# EAGLE design V2.2 (EAGLE 8.5.1)

## Sheet 1 of 8: ATMEGA32
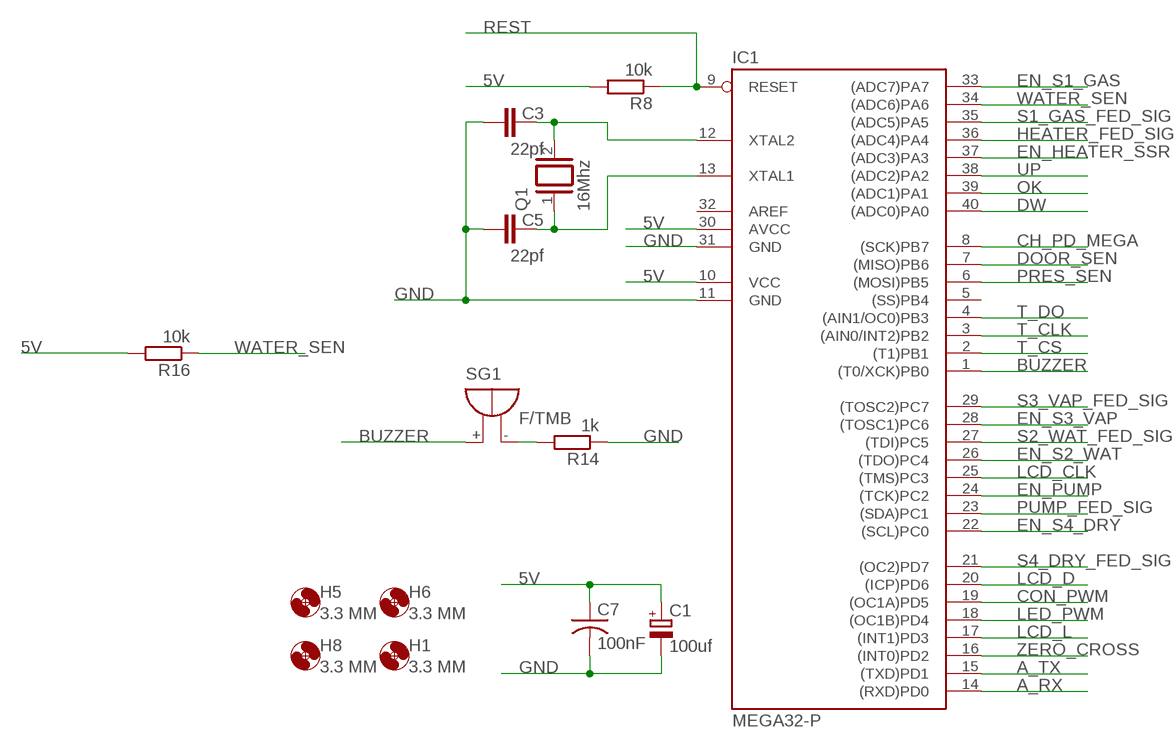
[diagram p0: schematic, sheet 1]

### Parts
C1  100uf  CPOL-EUE3.5-8  [E3,5-8]
C3  22pf  C-EU050-030X075  [C050-030X075]
C5  22pf  C-EU050-030X075  [C050-030X075]
C7  100nF  C-US050-035X075  [C050-035X075]
H1  3.3 MM  MOUNT-HOLE3.3  [3,3]
H5  3.3 MM  MOUNT-HOLE3.3  [3,3]
H6  3.3 MM  MOUNT-HOLE3.3  [3,3]
H8  3.3 MM  MOUNT-HOLE3.3  [3,3]
IC1  MEGA32-P  [DIL40]
Q1  16Mhz  XTAL/S  [QS]
R8  10k  R-EU_0207/10  [0207/10]
R14  1k  R-EU_0207/10  [0207/10]
R16  10k  R-EU_0207/10  [0207/10]
SG1  F/TMB  [F/TMB]

### Nets
5V: C1.+ C7.1 IC1.10(VCC) IC1.30(AVCC) R8.2 R16.2 ; also sheet 2,7,8
A_RX: IC1.14((RXD)PD0) ; also sheet 4
A_TX: IC1.15((TXD)PD1) ; also sheet 4
BUZZER: IC1.1((T0/XCK)PB0) SG1.+
CH_PD_MEGA: IC1.8((SCK)PB7) ; also sheet 4
CON_PWM: IC1.19((OC1A)PD5) ; also sheet 3
DOOR_SEN: IC1.7((MISO)PB6) ; also sheet 6
DW: IC1.40((ADC0)PA0) ; also sheet 6
EN_HEATER_SSR: IC1.37((ADC3)PA3) ; also sheet 6
EN_PUMP: IC1.24((TCK)PC2) ; also sheet 2
EN_S1_GAS: IC1.33((ADC7)PA7) ; also sheet 2
EN_S2_WAT: IC1.26((TDO)PC4) ; also sheet 2
EN_S3_VAP: IC1.28((TOSC1)PC6) ; also sheet 2
EN_S4_DRY: IC1.22((SCL)PC0) ; also sheet 2
GND: C1.- C3.1 C5.1 C7.2 IC1.11(GND) IC1.31(GND) R14.1 ; also sheet 2,3,4,5,6,7,8
HEATER_FED_SIG: IC1.36((ADC4)PA4)
LCD_CLK: IC1.25((TMS)PC3) ; also sheet 3
LCD_D: IC1.20((ICP)PD6) ; also sheet 3
LCD_L: IC1.17((INT1)PD3) ; also sheet 3
LED_PWM: IC1.18((OC1B)PD4) ; also sheet 3
N$7: C5.2 IC1.13(XTAL1) Q1.1
N$16: C3.2 IC1.12(XTAL2) Q1.2
N$62: R14.2 SG1.-
OK: IC1.39((ADC1)PA1) ; also sheet 6
PRES_SEN: IC1.6((MOSI)PB5) ; also sheet 6
PUMP_FED_SIG: IC1.23((SDA)PC1) ; also sheet 2
REST: IC1.9(RESET) R8.1 ; also sheet 4
S1_GAS_FED_SIG: IC1.35((ADC5)PA5) ; also sheet 2
S2_WAT_FED_SIG: IC1.27((TDI)PC5) ; also sheet 2
S3_VAP_FED_SIG: IC1.29((TOSC2)PC7) ; also sheet 2
S4_DRY_FED_SIG: IC1.21((OC2)PD7) ; also sheet 2
T_CLK: IC1.3((AIN0/INT2)PB2) ; also sheet 8
T_CS: IC1.2((T1)PB1) ; also sheet 8
T_DO: IC1.4((AIN1/OC0)PB3) ; also sheet 8
UP: IC1.38((ADC2)PA2) ; also sheet 6
WATER_SEN: IC1.34((ADC6)PA6) R16.1 ; also sheet 6
ZERO_CROSS: IC1.16((INT0)PD2) ; also sheet 5
Unconnected: IC1.5((SS)PB4) IC1.32(AREF)

## Sheet 2 of 8: Current Detect
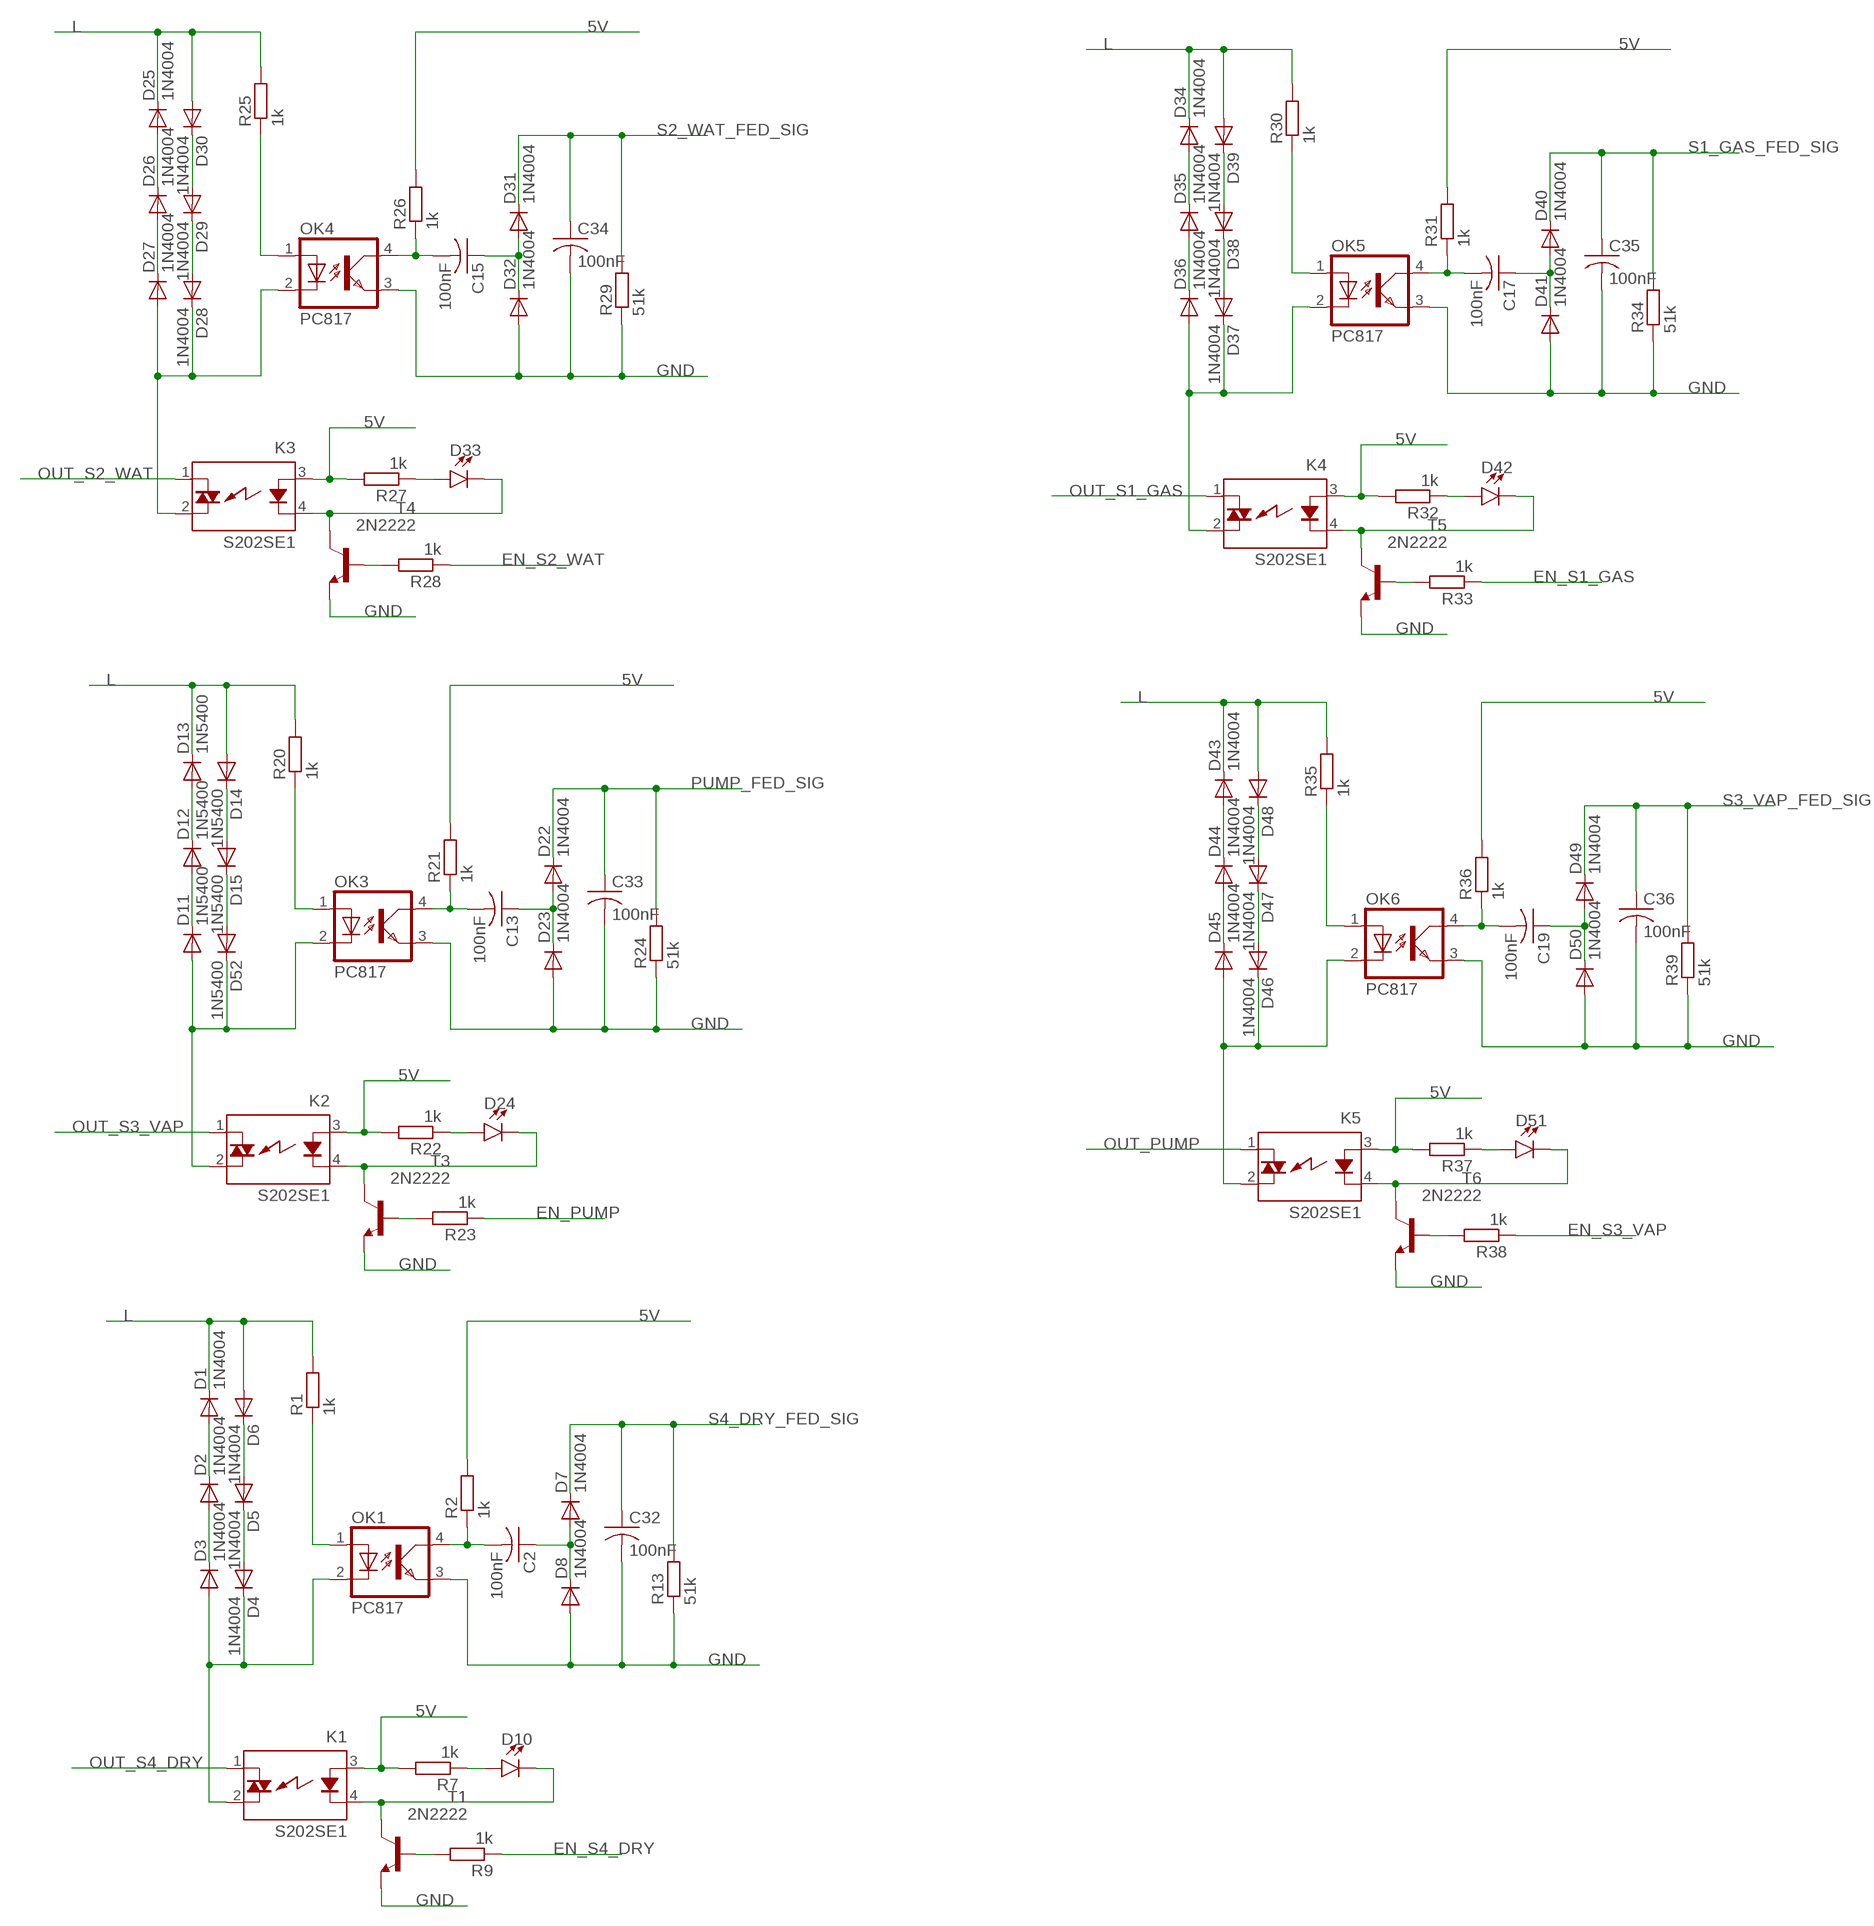
[diagram p1: schematic, sheet 2]

### Parts
C2  100nF  C-US050-035X075  [C050-035X075]
C13  100nF  C-US050-035X075  [C050-035X075]
C15  100nF  C-US050-035X075  [C050-035X075]
C17  100nF  C-US050-035X075  [C050-035X075]
C19  100nF  C-US050-035X075  [C050-035X075]
C32  100nF  C-US050-035X075  [C050-035X075]
C33  100nF  C-US050-035X075  [C050-035X075]
C34  100nF  C-US050-035X075  [C050-035X075]
C35  100nF  C-US050-035X075  [C050-035X075]
C36  100nF  C-US050-035X075  [C050-035X075]
D1  1N4004  [DO41-10]
D2  1N4004  [DO41-10]
D3  1N4004  [DO41-10]
D4  1N4004  [DO41-10]
D5  1N4004  [DO41-10]
D6  1N4004  [DO41-10]
D7  1N4004  [DO41-10]
D8  1N4004  [DO41-10]
D10  LED5MM  [LED_5MM]
D11  1N5400  [DO201-15]
D12  1N5400  [DO201-15]
D13  1N5400  [DO201-15]
D14  1N5400  [DO201-15]
D15  1N5400  [DO201-15]
D22  1N4004  [DO41-10]
D23  1N4004  [DO41-10]
D24  LED5MM  [LED_5MM]
D25  1N4004  [DO41-10]
D26  1N4004  [DO41-10]
D27  1N4004  [DO41-10]
D28  1N4004  [DO41-10]
D29  1N4004  [DO41-10]
D30  1N4004  [DO41-10]
D31  1N4004  [DO41-10]
D32  1N4004  [DO41-10]
D33  LED5MM  [LED_5MM]
D34  1N4004  [DO41-10]
D35  1N4004  [DO41-10]
D36  1N4004  [DO41-10]
D37  1N4004  [DO41-10]
D38  1N4004  [DO41-10]
D39  1N4004  [DO41-10]
D40  1N4004  [DO41-10]
D41  1N4004  [DO41-10]
D42  LED5MM  [LED_5MM]
D43  1N4004  [DO41-10]
D44  1N4004  [DO41-10]
D45  1N4004  [DO41-10]
D46  1N4004  [DO41-10]
D47  1N4004  [DO41-10]
D48  1N4004  [DO41-10]
D49  1N4004  [DO41-10]
D50  1N4004  [DO41-10]
D51  LED5MM  [LED_5MM]
D52  1N5400  [DO201-15]
K1  S202SE1  [S2XXEX]
K2  S202SE1  [S2XXEX]
K3  S202SE1  [S2XXEX]
K4  S202SE1  [S2XXEX]
K5  S202SE1  [S2XXEX]
OK1  PC817  [DIL04]
OK3  PC817  [DIL04]
OK4  PC817  [DIL04]
OK5  PC817  [DIL04]
OK6  PC817  [DIL04]
R1  1k  R-EU_0207/10  [0207/10]
R2  1k  R-EU_0207/10  [0207/10]
R7  1k  R-EU_0207/10  [0207/10]
R9  1k  R-EU_0207/10  [0207/10]
R13  51k  R-EU_0207/10  [0207/10]
R20  1k  R-EU_0207/10  [0207/10]
R21  1k  R-EU_0207/10  [0207/10]
R22  1k  R-EU_0207/10  [0207/10]
R23  1k  R-EU_0207/10  [0207/10]
R24  51k  R-EU_0207/10  [0207/10]
R25  1k  R-EU_0207/10  [0207/10]
R26  1k  R-EU_0207/10  [0207/10]
R27  1k  R-EU_0207/10  [0207/10]
R28  1k  R-EU_0207/10  [0207/10]
R29  51k  R-EU_0207/10  [0207/10]
R30  1k  R-EU_0207/10  [0207/10]
R31  1k  R-EU_0207/10  [0207/10]
R32  1k  R-EU_0207/10  [0207/10]
R33  1k  R-EU_0207/10  [0207/10]
R34  51k  R-EU_0207/10  [0207/10]
R35  1k  R-EU_0207/10  [0207/10]
R36  1k  R-EU_0207/10  [0207/10]
R37  1k  R-EU_0207/10  [0207/10]
R38  1k  R-EU_0207/10  [0207/10]
R39  51k  R-EU_0207/10  [0207/10]
T1  2N2222  [TO92-EBC-OVAL]
T3  2N2222  [TO92-EBC-OVAL]
T4  2N2222  [TO92-EBC-OVAL]
T5  2N2222  [TO92-EBC-OVAL]
T6  2N2222  [TO92-EBC-OVAL]

### Nets
5V: K1.3(A) K2.3(A) K3.3(A) K4.3(A) K5.3(A) R2.2 R7.2 R21.2 R22.2 R26.2 R27.2 R31.2 R32.2 R36.2 R37.2 ; also sheet 1,7,8
EN_PUMP: R23.1 ; also sheet 1
EN_S1_GAS: R33.1 ; also sheet 1
EN_S2_WAT: R28.1 ; also sheet 1
EN_S3_VAP: R38.1 ; also sheet 1
EN_S4_DRY: R9.1 ; also sheet 1
GND: C32.2 C33.2 C34.2 C35.2 C36.2 D8.A D23.A D32.A D41.A D50.A OK1.3(EMIT) OK3.3(EMIT) OK4.3(EMIT) OK5.3(EMIT) OK6.3(EMIT) R13.1 R24.1 R29.1 R34.1 R39.1 T1.E T3.E T4.E T5.E T6.E ; also sheet 1,3,4,5,6,7,8
L: D1.C D6.A D13.C D14.A D25.C D30.A D34.C D39.A D43.C D48.A R1.2 R20.2 R25.2 R30.2 R35.2 ; also sheet 6
N$1: D2.A D3.C
N$2: D1.A D2.C
N$3: C2.2 OK1.4(COL) R2.1
N$4: C2.1 D7.A D8.C
N$5: D5.A D6.C
N$6: D4.A D5.C
N$8: D10.K(C) K1.4(K) T1.C
N$9: OK1.1(A) R1.1
N$10: D11.C D12.A
N$11: D10.A R7.1
N$13: R9.2 T1.B
N$14: D3.A D4.C K1.2(DS2) OK1.2(C)
N$15: D12.C D13.A
N$17: D14.C D15.A
N$18: D15.C D52.A
N$19: OK3.1(A) R20.1
N$20: C13.2 OK3.4(COL) R21.1
N$21: C13.1 D22.A D23.C
N$23: D24.A R22.1
N$24: D24.K(C) K2.4(K) T3.C
N$25: R23.2 T3.B
N$26: D26.A D27.C
N$27: D25.A D26.C
N$28: D29.A D30.C
N$29: D28.A D29.C
N$30: OK4.1(A) R25.1
N$31: C15.2 OK4.4(COL) R26.1
N$32: C15.1 D31.A D32.C
N$33: D27.A D28.C K3.2(DS2) OK4.2(C)
N$34: D33.A R27.1
N$35: D33.K(C) K3.4(K) T4.C
N$36: R28.2 T4.B
N$37: D35.A D36.C
N$38: D34.A D35.C
N$39: D38.A D39.C
N$40: D37.A D38.C
N$41: OK5.1(A) R30.1
N$42: C17.2 OK5.4(COL) R31.1
N$43: C17.1 D40.A D41.C
N$44: D36.A D37.C K4.2(DS2) OK5.2(C)
N$45: D42.A R32.1
N$46: D42.K(C) K4.4(K) T5.C
N$51: D11.A D52.C K2.2(DS2) OK3.2(C)
N$52: R33.2 T5.B
N$53: D44.A D45.C
N$56: D43.A D44.C
N$57: D47.A D48.C
N$58: D46.A D47.C
N$59: OK6.1(A) R35.1
N$60: C19.2 OK6.4(COL) R36.1
N$61: C19.1 D49.A D50.C
N$63: D45.A D46.C K5.2(DS2) OK6.2(C)
N$64: D51.A R37.1
N$65: D51.K(C) K5.4(K) T6.C
N$66: R38.2 T6.B
OUT_PUMP: K5.1(DS1) ; also sheet 6
OUT_S1_GAS: K4.1(DS1) ; also sheet 6
OUT_S2_WAT: K3.1(DS1) ; also sheet 6
OUT_S3_VAP: K2.1(DS1) ; also sheet 6
OUT_S4_DRY: K1.1(DS1) ; also sheet 6
PUMP_FED_SIG: C33.1 D22.C R24.2 ; also sheet 1
S1_GAS_FED_SIG: C35.1 D40.C R34.2 ; also sheet 1
S2_WAT_FED_SIG: C34.1 D31.C R29.2 ; also sheet 1
S3_VAP_FED_SIG: C36.1 D49.C R39.2 ; also sheet 1
S4_DRY_FED_SIG: C32.1 D7.C R13.2 ; also sheet 1

## Sheet 3 of 8: LCD_Shift
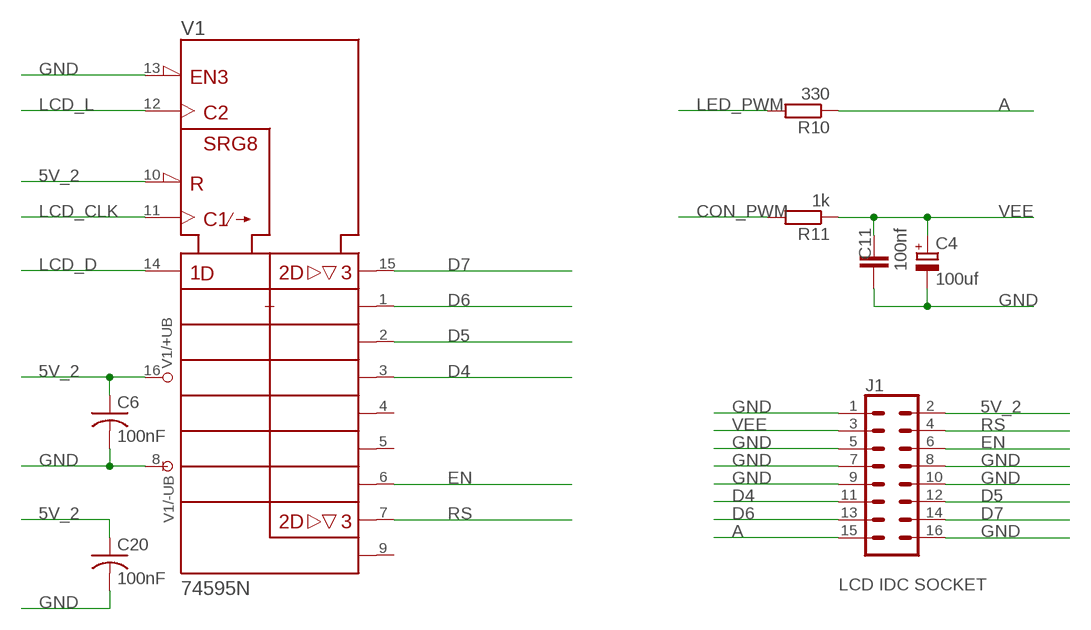
[diagram p2: schematic, sheet 3]

### Parts
C4  100uf  CPOL-EUE3.5-8  [E3,5-8]
C6  100nF  C-US050-035X075  [C050-035X075]
C11  100nf  C-EU050-030X075  [C050-030X075]
C20  100nF  C-US050-035X075  [C050-035X075]
J1  CONN_08X2  [2X8]
R10  330  R-EU_0207/10  [0207/10]
R11  1k  R-EU_0207/10  [0207/10]
V1  74595N  [DIL16]

### Nets
5V_2: C6.1 C20.1 J1.2 V1.10(!SRCLR) V1.16(+UB) ; also sheet 5,7
A: J1.15 R10.1
CON_PWM: R11.2 ; also sheet 1
D4: J1.11 V1.3(QD)
D5: J1.12 V1.2(QC)
D6: J1.13 V1.1(QB)
D7: J1.14 V1.15(QA)
EN: J1.6 V1.6(QG)
GND: C4.- C6.2 C11.1 C20.2 J1.1 J1.5 J1.7 J1.8 J1.9 J1.10 J1.16 V1.8(-UB) V1.13(!G) ; also sheet 1,2,4,5,6,7,8
LCD_CLK: V1.11(SRCK) ; also sheet 1
LCD_D: V1.14(SER) ; also sheet 1
LCD_L: V1.12(RCK) ; also sheet 1
LED_PWM: R10.2 ; also sheet 1
RS: J1.4 V1.7(QH)
VEE: C4.+ C11.2 J1.3 R11.1
Unconnected: V1.4(QE) V1.5(QF) V1.9(QH*)

### Notes on the sheet
- LCD IDC SOCKET

## Sheet 4 of 8: ESP LINK
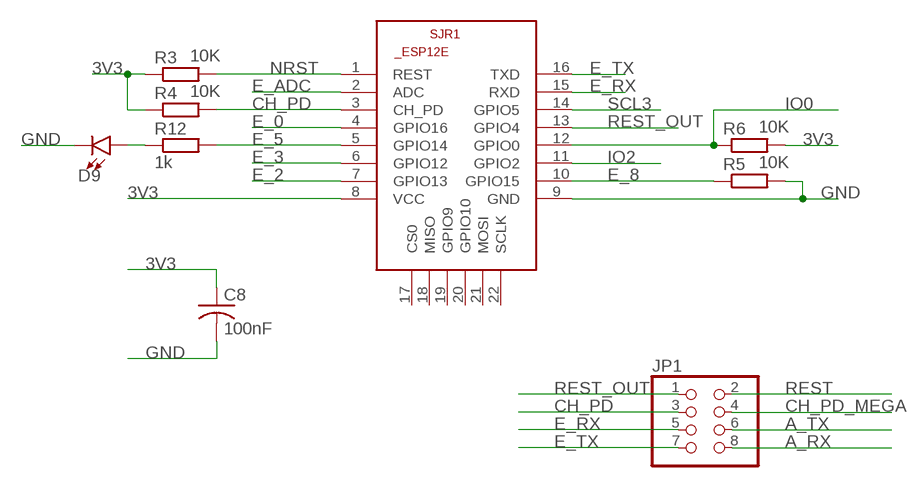
[diagram p3: schematic, sheet 4]

### Parts
C8  100nF  C-US050-035X075  [C050-035X075]
D9  LED5MM  [LED_5MM]
JP1  PINHD-2X4  [2X04]
R3  10K  R-EU_0207/10  [0207/10]
R4  10K  R-EU_0207/10  [0207/10]
R5  10K  R-EU_0207/10  [0207/10]
R6  10K  R-EU_0207/10  [0207/10]
R12  1k  R-EU_0207/10  [0207/10]
SJR1  ESP8266-12EESP12E  [ESP8266-ESP12E]

### Nets
3V3: C8.1 R3.1 R4.1 R6.2 SJR1.8(VCC) ; also sheet 7
A_RX: JP1.8 ; also sheet 1
A_TX: JP1.6 ; also sheet 1
CH_PD: JP1.3 R4.2 SJR1.3(CH_PD)
CH_PD_MEGA: JP1.4 ; also sheet 1
E_0: SJR1.4(GPIO16)
E_2: SJR1.7(GPIO13)
E_3: SJR1.6(GPIO12)
E_5: R12.2 SJR1.5(GPIO14)
E_8: R5.1 SJR1.10(GPIO15)
E_ADC: SJR1.2(ADC)
E_RX: JP1.5 SJR1.15(RXD)
E_TX: JP1.7 SJR1.16(TXD)
GND: C8.2 D9.K(C) R5.2 SJR1.9(GND) ; also sheet 1,2,3,5,6,7,8
IO0: R6.1 SJR1.12(GPIO0)
IO2: SJR1.11(GPIO2)
N$12: D9.A R12.1
NRST: R3.2 SJR1.1(REST)
REST: JP1.2 ; also sheet 1
REST_OUT: JP1.1 SJR1.13(GPIO4)
SCL3: SJR1.14(GPIO5)
Unconnected: SJR1.17(CS0) SJR1.18(MISO) SJR1.19(GPIO9) SJR1.20(GPIO10) SJR1.21(MOSI) SJR1.22(SCLK)

## Sheet 5 of 8: Zero_Cross Detect
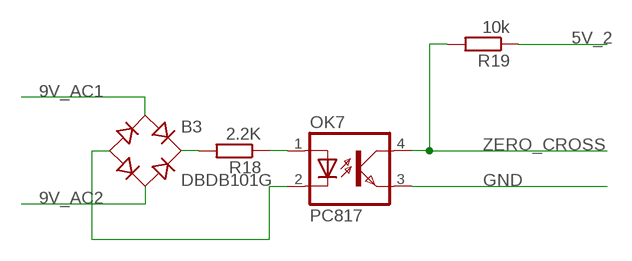
[diagram p4: schematic, sheet 5]

### Parts
B3  DBDB101G  [DB]
OK7  PC817  [DIL04]
R18  2.2K  R-EU_0207/10  [0207/10]
R19  10k  R-EU_0207/10  [0207/10]

### Nets
5V_2: R19.1 ; also sheet 3,7
9V_AC1: B3.AC1 ; also sheet 6,7
9V_AC2: B3.AC2 ; also sheet 6,7
GND: OK7.3(EMIT) ; also sheet 1,2,3,4,6,7,8
N$47: B3.+ R18.2
N$48: OK7.1(A) R18.1
N$49: B3.- OK7.2(C)
ZERO_CROSS: OK7.4(COL) R19.2 ; also sheet 1

## Sheet 6 of 8: Terminals
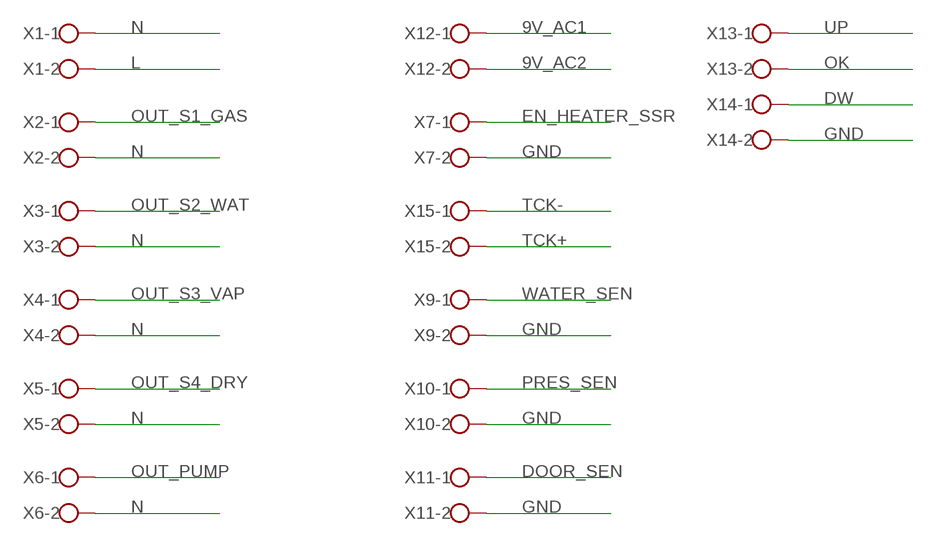
[diagram p5: schematic, sheet 6]

### Parts
X1  W237-102  [W237-102]
X2  W237-102  [W237-102]
X3  W237-102  [W237-102]
X4  W237-102  [W237-102]
X5  W237-102  [W237-102]
X6  W237-102  [W237-102]
X7  W237-102  [W237-102]
X9  W237-102  [W237-102]
X10  W237-102  [W237-102]
X11  W237-102  [W237-102]
X12  W237-102  [W237-102]
X13  W237-102  [W237-102]
X14  W237-102  [W237-102]
X15  W237-102  [W237-102]

### Nets
9V_AC1: X12.1 ; also sheet 5,7
9V_AC2: X12.2 ; also sheet 5,7
DOOR_SEN: X11.1 ; also sheet 1
DW: X14.1 ; also sheet 1
EN_HEATER_SSR: X7.1 ; also sheet 1
GND: X7.2 X9.2 X10.2 X11.2 X14.2 ; also sheet 1,2,3,4,5,7,8
L: X1.2 ; also sheet 2
N: X1.1 X2.2 X3.2 X4.2 X5.2 X6.2
OK: X13.2 ; also sheet 1
OUT_PUMP: X6.1 ; also sheet 2
OUT_S1_GAS: X2.1 ; also sheet 2
OUT_S2_WAT: X3.1 ; also sheet 2
OUT_S3_VAP: X4.1 ; also sheet 2
OUT_S4_DRY: X5.1 ; also sheet 2
PRES_SEN: X10.1 ; also sheet 1
TCK+: X15.2 ; also sheet 8
TCK-: X15.1 ; also sheet 8
UP: X13.1 ; also sheet 1
WATER_SEN: X9.1 ; also sheet 1

## Sheet 7 of 8: POWER
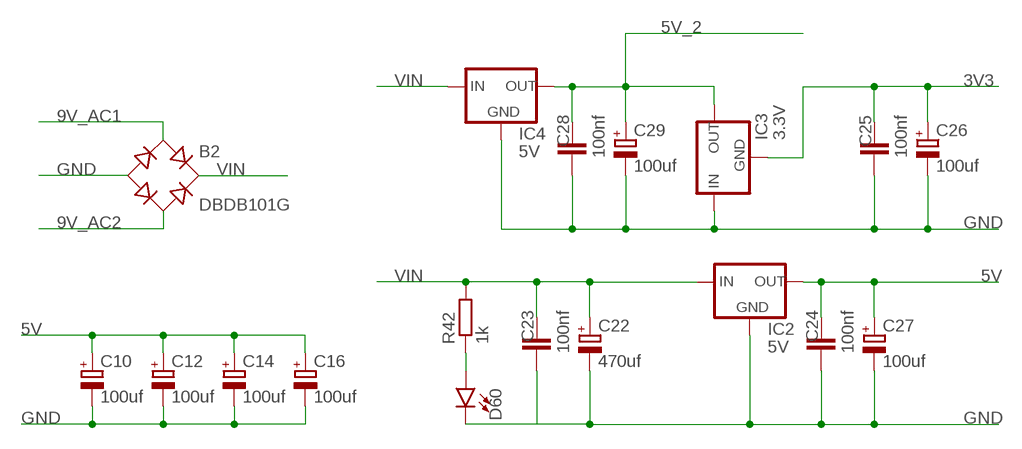
[diagram p6: schematic, sheet 7]

### Parts
B2  DBDB101G  [DB]
C10  100uf  CPOL-EUE3.5-8  [E3,5-8]
C12  100uf  CPOL-EUE3.5-8  [E3,5-8]
C14  100uf  CPOL-EUE3.5-8  [E3,5-8]
C16  100uf  CPOL-EUE3.5-8  [E3,5-8]
C22  470uf  CPOL-EUE3.5-8  [E3,5-8]
C23  100nf  C-EU050-030X075  [C050-030X075]
C24  100nf  C-EU050-030X075  [C050-030X075]
C25  100nf  C-EU050-030X075  [C050-030X075]
C26  100uf  CPOL-EUE3.5-8  [E3,5-8]
C27  100uf  CPOL-EUE3.5-8  [E3,5-8]
C28  100nf  C-EU050-030X075  [C050-030X075]
C29  100uf  CPOL-EUE3.5-8  [E3,5-8]
D60  LED5MM  [LED_5MM]
IC2  5V  V_REG_78XXSIDE  [78XXL]
IC3  3.3V  V_REG_78XXSIDE  [78XXL]
IC4  5V  V_REG_78XXSIDE  [78XXL]
R42  1k  R-EU_0207/10  [0207/10]

### Nets
3V3: C25.2 C26.+ IC3.GND ; also sheet 4
5V: C10.+ C12.+ C14.+ C16.+ C24.2 C27.+ IC2.OUT ; also sheet 1,2,8
5V_2: C28.2 C29.+ IC3.OUT IC4.OUT ; also sheet 3,5
9V_AC1: B2.AC1 ; also sheet 5,6
9V_AC2: B2.AC2 ; also sheet 5,6
GND: B2.- C10.- C12.- C14.- C16.- C22.- C23.1 C24.1 C25.1 C26.- C27.- C28.1 C29.- D60.K(C) IC2.GND IC3.IN IC4.GND ; also sheet 1,2,3,4,5,6,8
N$74: D60.A R42.1
VIN: B2.+ C22.+ C23.2 IC2.IN IC4.IN R42.2

## Sheet 8 of 8: Thermocoupler
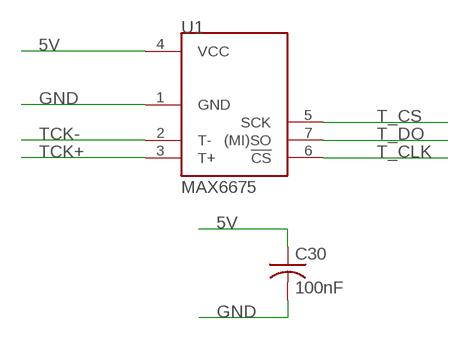
[diagram p7: schematic, sheet 8]

### Parts
C30  100nF  C-US050-035X075  [C050-035X075]
U1  MAX6675  [SOIC8]

### Nets
5V: C30.1 U1.4(VCC) ; also sheet 1,2,7
GND: C30.2 U1.1(GND) ; also sheet 1,2,3,4,5,6,7
T_CLK: U1.6(!CS) ; also sheet 1
T_CS: U1.5(SCK) ; also sheet 1
T_DO: U1.7((MI)SO) ; also sheet 1
TCK+: U1.3(T+) ; also sheet 6
TCK-: U1.2(T-) ; also sheet 6

## Library data of the parts
B2 B3 = rectifier:DB?*G: Single Phase 1.0 AMP Glass Passivated Bridge Rectifier Taiwan Semiconductor Co.,Ltd. - TSC Source: http://www.taiwansemi.com/TSCbig5/ezcatfiles/cust/img/img/db101g.pdf http://www.ts.com.tw/db/pictures/modules/PDT/PDT060207001/DBLS201G.pdf
C1 C4 C10 C12 C14 C16 C22 C26 C27 C29 = rcl:CPOL-EU: POLARIZED CAPACITOR, European symbol
C2 C6-C8 C13 C15 C17 C19 C20 C30 C32-C36 = rcl:C-US: CAPACITOR, American symbol; SPICEPREFIX: C
C3 C5 C11 C23-C25 C28 = rcl:C-EU: CAPACITOR, European symbol
D1-D8 D22 D23 D25-D32 D34-D41 D43-D50 = adafruit:1N4004: DIODE General purpose 1N400x type rectifier (With bigger pads) http://www.ladyada.net/library/pcb/eaglelibrary.html
D9 D10 D24 D33 D42 D51 D60 = SparkFun-LED:LED: LED (Generic) Standard schematic elements and footprints for 5mm, 3mm, 1206, and 0603 sized LEDs. Generic LEDs with no color specified.
D11-D15 D52 = diode:1N5400: DIODE standard rectifier, 3 A, 50 V (Motorola)
H1 H5 H6 H8 = holes:MOUNT-HOLE: MOUNTING HOLE with drill center marker
IC1 = atmel:MEGA32-P: MICROCONTROLLER 32 Kbytes FLASH 2 Kbytes SRAM 1 Kbytes EEPROM USART 8-channel 10 bit ADC Source: www.atmel.com .. doc2503.pdf; MPN: ATMEGA32-16PU; OC_FARNELL: 1661729; OC_NEWARK: 51P1794
IC2-IC4 = SparkFun:V_REG_78XX: Voltage Regulator Standard 7805 5V regulator. IGO (Input Ground Output). Spark Fun Electronics SKU : COM-00107
J1 = SparkFun-Connectors:CONN_08X2: Multi connection point. Often used as Generic Header-pin footprint for 0.1 inch spaced/style header connections You can populate with any combo of single row headers, but if you'd like an exact match, check this: Header - 2x8 (Male, 0.1") <https://www.sparkfun.com/products/13156> (PRT-13156) On any of the 0.1 inch spaced packages, you can populate with these: Break Away Headers - Straight <https://www.sparkfun.com/products/116> (PRT-00116) Break Away Male Headers - Right Angle <https://www.sparkfun.com/products/553> (PRT-00553) Female Headers <https://www.sparkfun.com/products/115> (PRT-00115) Break Away Headers - Machine Pin <https://www.sparkfun.com/products/117> (PRT-00117) Break Away Female Headers - Swiss Machine Pin <https://www.sparkfun.com/products/743> (PRT-00743)
JP1 = pinhead:PINHD-2X4: PIN HEADER
K1-K5 = relay:S2*: SIP Type SSR for Medium Power Control SHARP Source: 168149-da-01-en-Solid_State_Relais_S_202_SE1_SE2.pdf; OC_FARNELL: unknown; OC_NEWARK: unknown
OK1 OK3-OK7 = optocoupler-2:PC817: SHARP OPTO COUPLER
Q1 = special:XTAL/S: CRYSTAL
R1 R2 R7-R14 R16 R18-R39 R42 = rcl:R-EU_: RESISTOR, European symbol
R3-R6 = rcl:R-EU_: RESISTOR, European symbol; SPICEPREFIX: R
SG1 = buzzer:F/TMB: BUZZER Source: Buerklin; OC_FARNELL: unknown; OC_NEWARK: unknown
SJR1 = esp12e:ESP8266-12E: ESP8266-12E Library for Eagle CAD The author not responsible for any damages or errors!. Created by Suhail jr.lt;/author>
T1 T3-T6 = adafruit:2N2222: NPN TRANSISTOR Big oval pads
U1 = SparkFun-Retired:MAX6675: Cold-Junction-Compensated K-Thermocoupleto-Digital Converter (0°C to +1024°C) The MAX6675 performs cold-junction compensation and digitizes the signal from a type-K thermocouple. The data is output in a 12-bit resolution, SPI™-compatible, read-only format. This converter resolves temperatures to 0.25°C, allows readings as high as +1024°C, and exhibits thermocouple accuracy of 8LSBs for temperatures ranging from 0°C to +700°C. Dead Prototype: IC-12512; PROD_ID: IC-12512
V1 = 74ttl-din:74*595: 8-bit SHIFT REGISTER, output latch
X1-X7 X9-X15 = con-wago-500:W237-102: WAGO SCREW CLAMP; MPN: 237-102; OC_FARNELL: unknown; OC_NEWARK: 70K9898

## Board
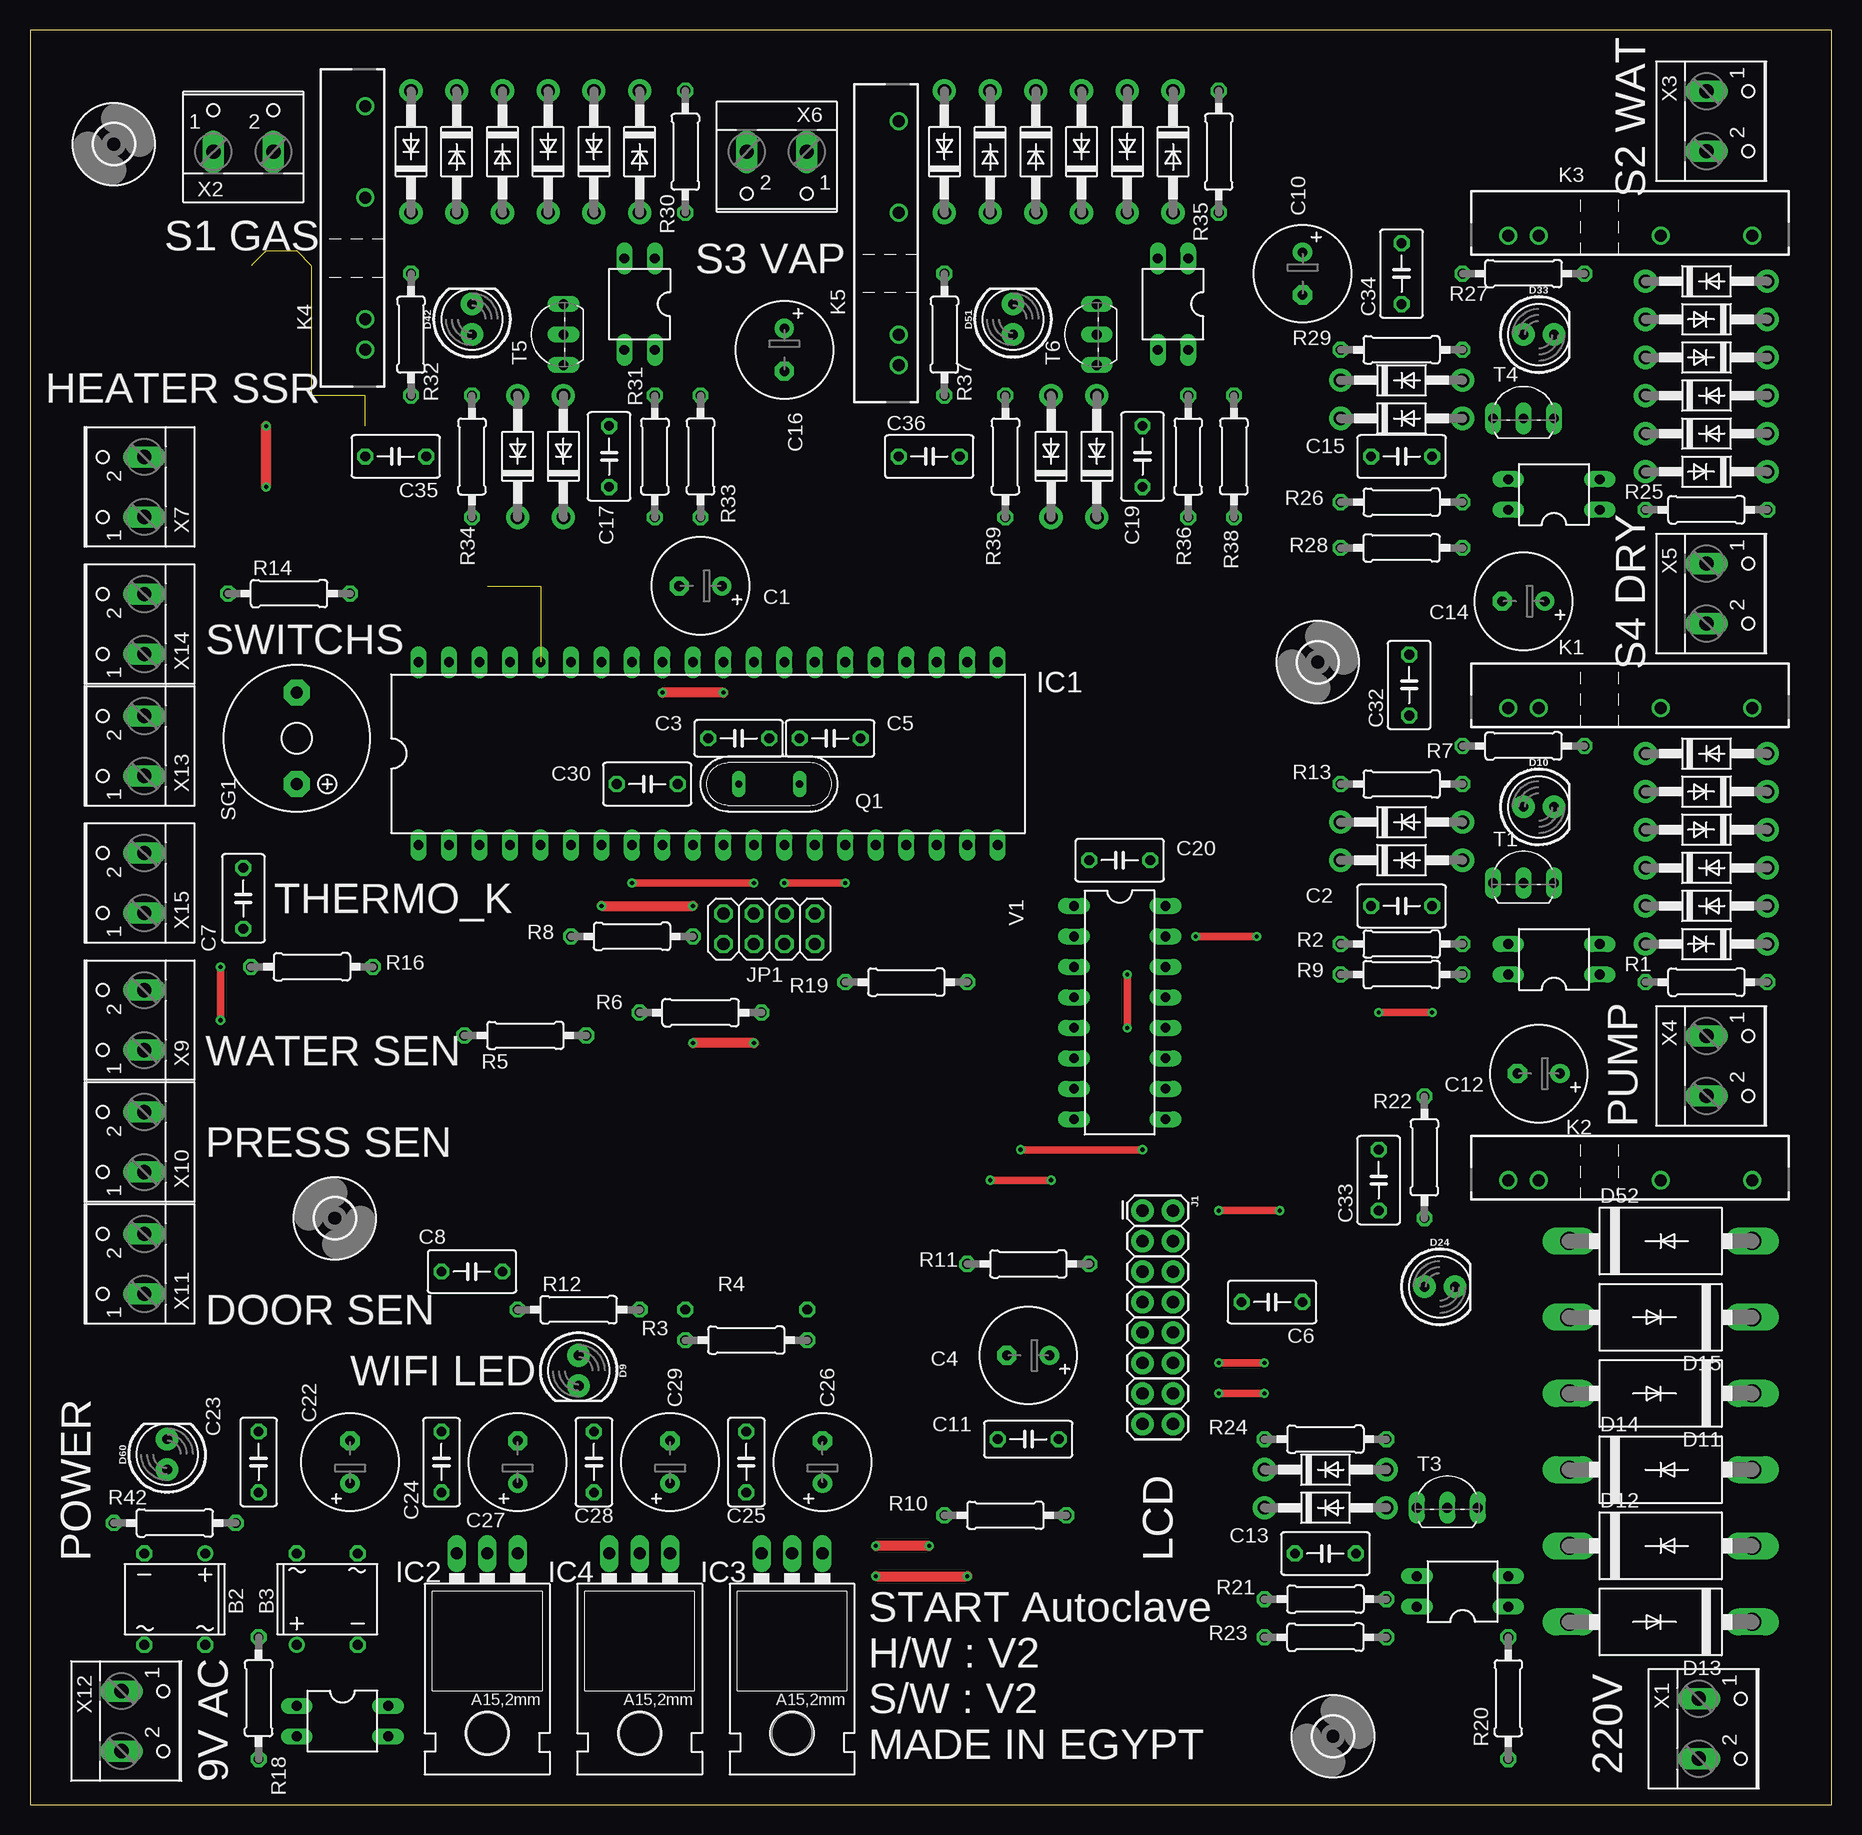
[diagram p8: board, top side]
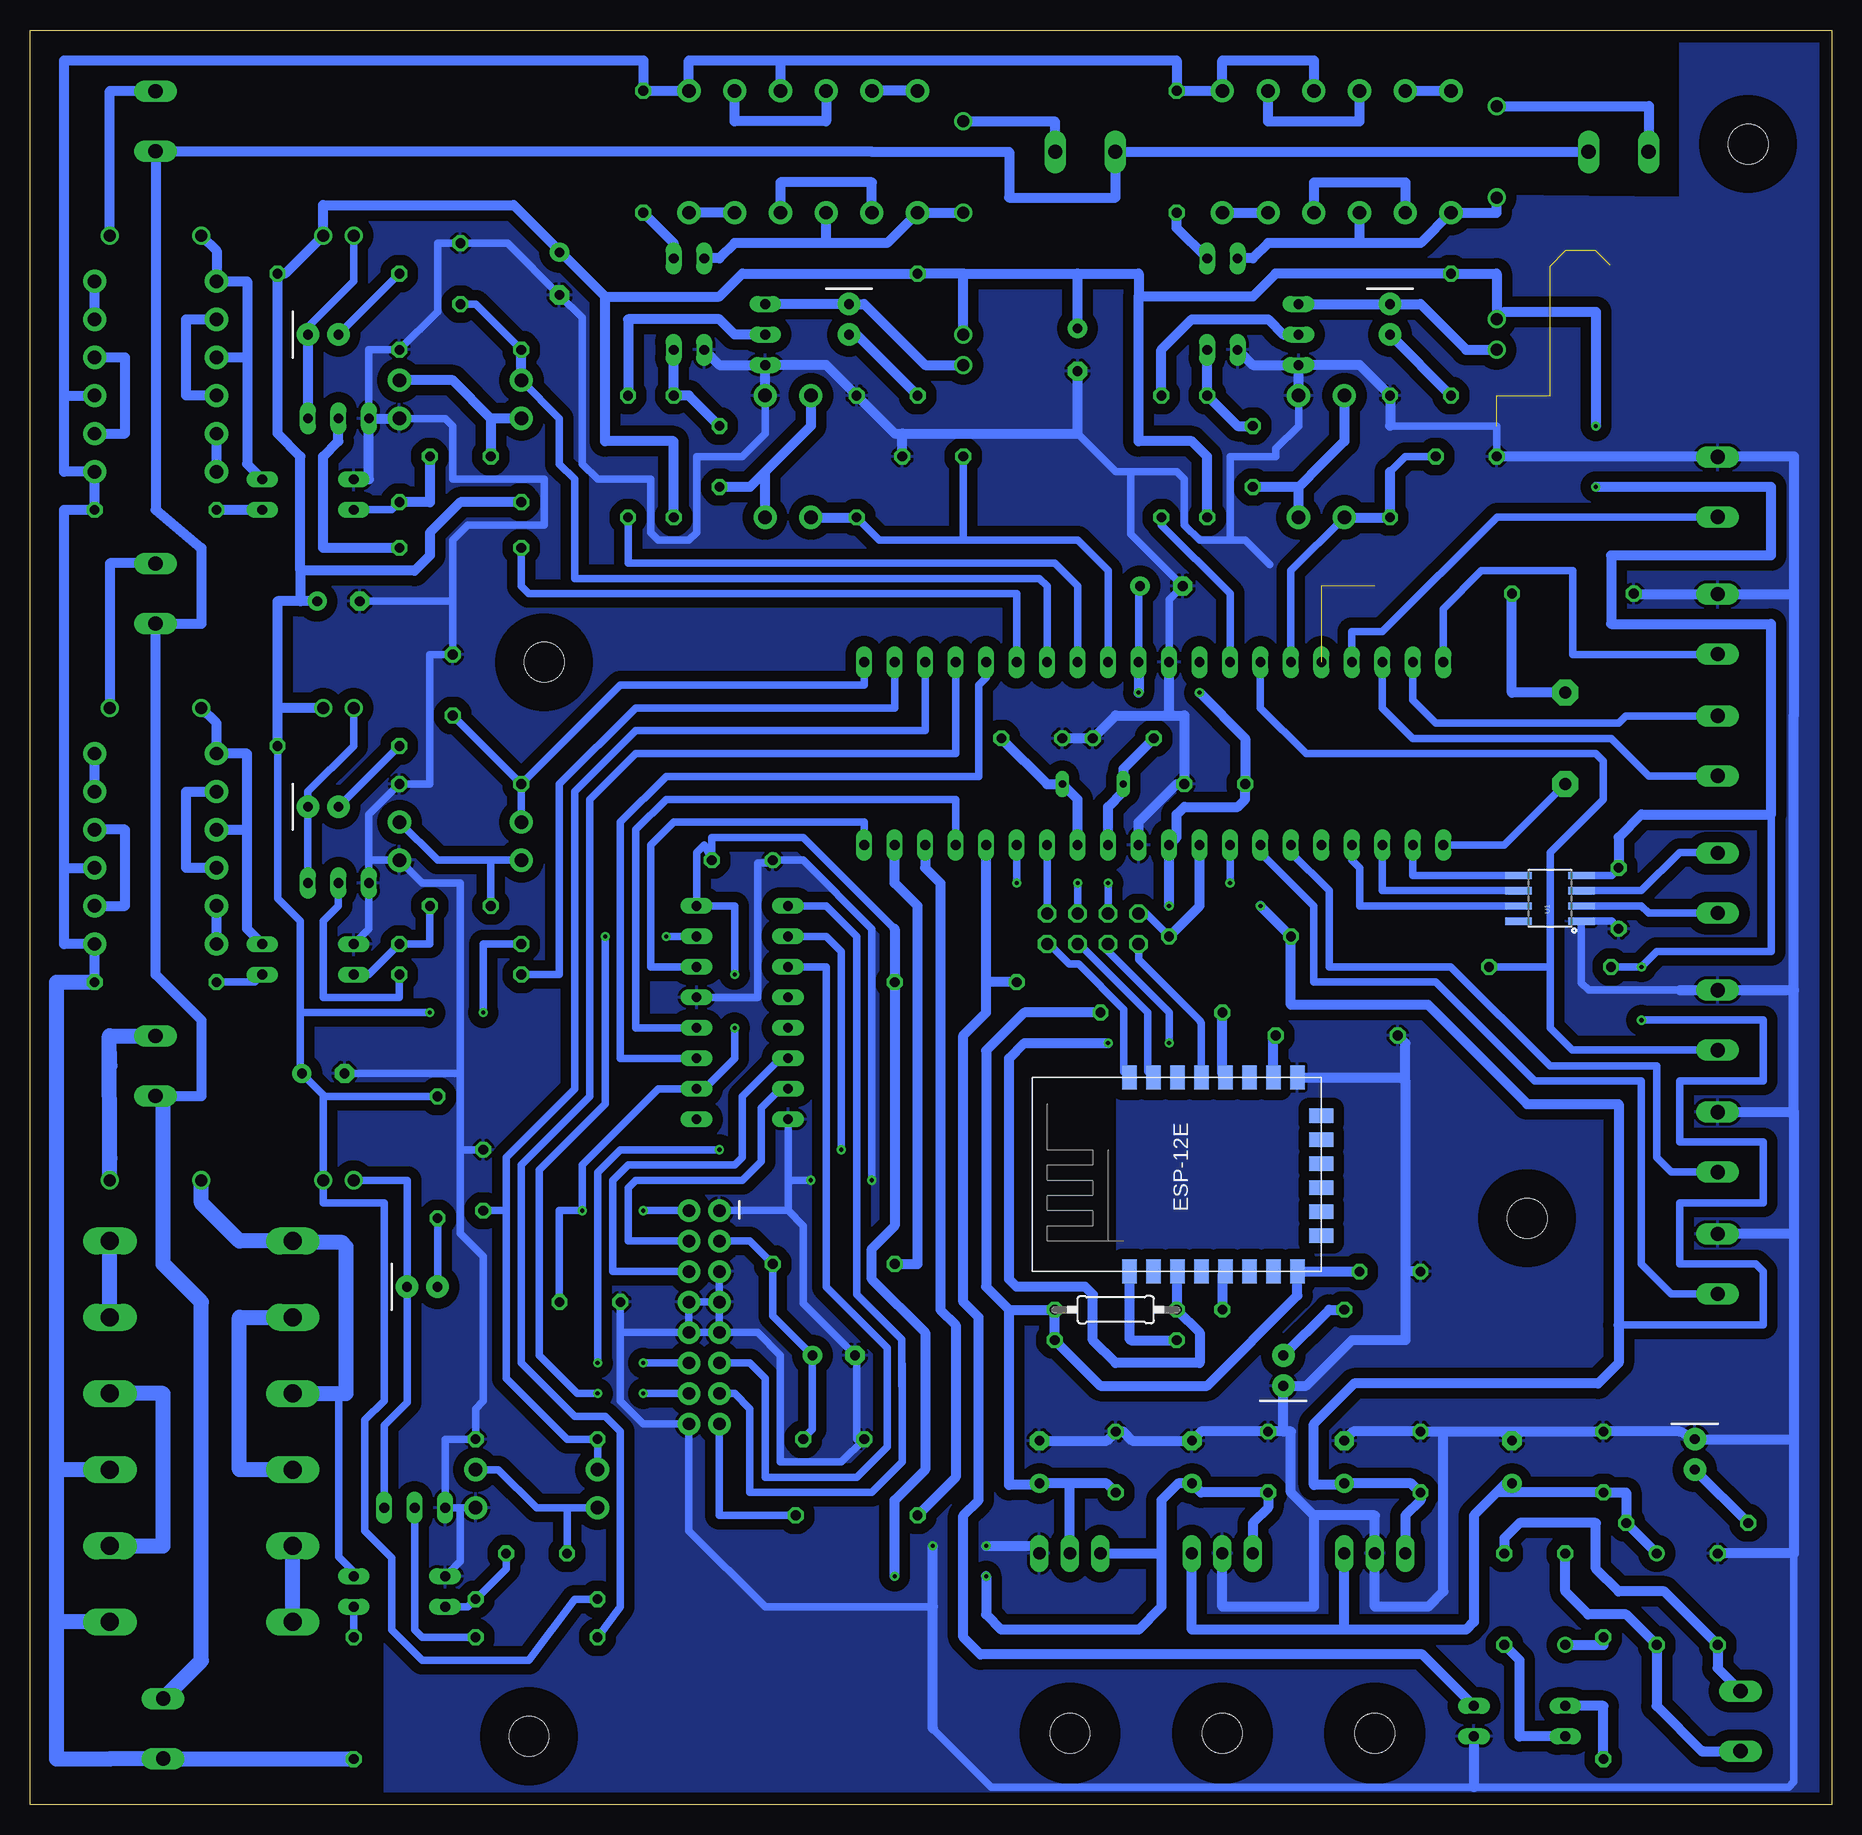
[diagram p9: board, bottom side, seen from below]

Size 150.16 x 147.95 mm. Coordinates in mm from the lower left corner, seen from the top.
Outline: 0,0 150.16,0 150.16,147.95 0,147.95 0,0
Copper layers (1*16): Top 0.035mm / dielectric 1.5mm / Bottom 0.035mm
Design rules "default *": minimum track width 6mil, minimum drill 0.35mm, track to track 35mil, track to pad 35mil, pad to pad 6mil, via to via 6mil, smd to smd 6mil, copper to edge 40mil, drill to drill 6mil, minimum pad ring 10mil, minimum via ring 8mil, stop-mask expansion 4mil, vias tented up to drill 0mil, thermal gap 10mil

### Footprints (pad centres in the part's own frame; a part is rotated, then mirrored left to right if it is on the bottom)
DB = drill 0.813: + -2.54,-3.81 | drill 0.813 octagon: - 2.54,-3.81; AC1 2.54,3.81; AC2 -2.54,3.81
E3,5-8 = drill 0.813 pad 1.6: + -1.778,0 | drill 0.813 pad 1.6 octagon: - 1.778,0
C050-035X075 = drill 0.813 octagon: 1 -2.54,0; 2 2.54,0
C050-030X075 = drill 0.813 octagon: 1 -2.54,0; 2 2.54,0
DO41-10 = drill 1.118 pad 1.93: A 5.08,0; C -5.08,0
LED_5MM = drill 0.813 pad 1.88: A -1.27,0; K 1.27,0
DO201-15 = drill 1.499 long: A 7.62,0; C -7.62,0
3,3 = hole 3.3: 0,0
DIL40 = drill 0.813 long: 1 -24.13,-7.62; 2 -21.59,-7.62; 3 -19.05,-7.62; 4 -16.51,-7.62; 5 -13.97,-7.62; 6 -11.43,-7.62; 7 -8.89,-7.62; 8 -6.35,-7.62; 9 -3.81,-7.62; 10 -1.27,-7.62; 11 1.27,-7.62; 12 3.81,-7.62; 13 6.35,-7.62; 14 8.89,-7.62; 15 11.43,-7.62; 16 13.97,-7.62; 17 16.51,-7.62; 18 19.05,-7.62; 19 21.59,-7.62; 20 24.13,-7.62; 21 24.13,7.62; 22 21.59,7.62; 23 19.05,7.62; 24 16.51,7.62; 25 13.97,7.62; 26 11.43,7.62; 27 8.89,7.62; 28 6.35,7.62; 29 3.81,7.62; 30 1.27,7.62; 31 -1.27,7.62; 32 -3.81,7.62; 33 -6.35,7.62; 34 -8.89,7.62; 35 -11.43,7.62; 36 -13.97,7.62; 37 -16.51,7.62; 38 -19.05,7.62; 39 -21.59,7.62; 40 -24.13,7.62
78XXL = drill 1.016 long: GND 0,-3.81; IN -2.54,-3.81; OUT 2.54,-3.81 | hole 3.302: 0,11.176
2X8 = drill 1.016 pad 1.88: 1 0,0; 2 0,2.54; 3 2.54,0; 4 2.54,2.54; 5 5.08,0; 6 5.08,2.54; 7 7.62,0; 8 7.62,2.54; 9 10.16,0; 10 10.16,2.54; 11 12.7,0; 12 12.7,2.54; 13 15.24,0; 14 15.24,2.54; 15 17.78,0; 16 17.78,2.54
2X04 = drill 1.016 octagon: 1 -3.81,-1.27; 2 -3.81,1.27; 3 -1.27,-1.27; 4 -1.27,1.27; 5 1.27,-1.27; 6 1.27,1.27; 7 3.81,-1.27; 8 3.81,1.27
S2XXEX = drill 1: 1 -12.7,0; 2 -5.08,0; 3 5.08,0; 4 7.62,0
DIL04 = drill 0.813 long: 1 -1.27,-3.81; 2 1.27,-3.81; 3 1.27,3.81; 4 -1.27,3.81
QS = drill 0.61 long: 1 -2.54,0; 2 2.54,0
0207/10 = drill 0.813 octagon: 1 -5.08,0; 2 5.08,0
F/TMB = drill 1.016 pad 2.159 octagon: + 3.81,0; - -3.81,0
ESP8266-ESP12E = smd 2 x 1.2: 1 -7.62,5.84; 2 -7.62,3.84; 3 -7.62,1.84; 4 -7.62,-0.16; 5 -7.62,-2.16; 6 -7.62,-4.16; 7 -7.62,-6.16; 8 -7.62,-8.16; 9 8.58,-8.16; 10 8.58,-6.16; 11 8.58,-4.16; 12 8.58,-2.16; 13 8.58,-0.16; 14 8.58,1.84; 15 8.58,3.84; 16 8.58,5.84 | smd 1.2 x 2: 17 -4.62,-10.16; 18 -2.62,-10.16; 19 -0.62,-10.16; 20 1.38,-10.16; 21 3.38,-10.16; 22 5.38,-10.16
TO92-EBC-OVAL = drill 0.813 long: B 0,-1.27; C 2.54,-1.27; E -2.54,-1.27
SOIC8 = smd 0.61 x 2.21: 1 -1.905,-2.616; 2 -0.635,-2.616; 3 0.635,-2.616; 4 1.905,-2.616; 5 1.905,2.616; 6 0.635,2.616; 7 -0.635,2.616; 8 -1.905,2.616
DIL16 = drill 0.813 long: 1 -8.89,-3.81; 2 -6.35,-3.81; 3 -3.81,-3.81; 4 -1.27,-3.81; 5 1.27,-3.81; 6 3.81,-3.81; 7 6.35,-3.81; 8 8.89,-3.81; 9 8.89,3.81; 10 6.35,3.81; 11 3.81,3.81; 12 1.27,3.81; 13 -1.27,3.81; 14 -3.81,3.81; 15 -6.35,3.81; 16 -8.89,3.81
W237-102 = drill 1.194 long: 1 -2.5,-1.27; 2 2.5,-1.27

### Placement (x,y rotation side)
B2  12.06,17.14 180 top
B3  24.77,17.14 0 top
C1  55.88,101.6 180 top
C2  114.3,74.93 0 top
C3  59.05,88.9 180 top
C4  83.19,37.47 180 top
C5  66.67,88.9 0 top
C6  103.5,41.91 180 top
C7  17.78,75.56 270 top
C8  36.83,44.45 180 top
C10  106.05,127.64 270 top
C11  83.19,30.48 0 top
C12  125.73,60.96 180 top
C13  107.95,20.95 0 top
C14  124.46,100.33 180 top
C15  114.3,112.39 0 top
C16  62.87,121.28 270 top
C17  48.26,112.39 90 top
C19  92.71,112.39 90 top
C20  90.81,78.74 180 top
C22  26.67,28.57 90 top
C23  19.05,28.57 270 top
C24  34.29,28.57 270 top
C25  59.69,28.57 270 top
C26  66.04,28.57 90 top
C27  40.64,28.57 90 top
C28  46.99,28.57 270 top
C29  53.34,28.57 90 top
C30  51.44,85.09 0 top
C32  114.94,93.34 90 top
C33  112.39,52.07 90 top
C34  114.3,127.64 90 top
C35  30.48,112.39 180 top
C36  74.93,112.39 0 top
D1  139.7,71.75 180 top
D2  139.7,74.93 0 top
D3  139.7,81.28 180 top
D4  139.7,87.63 0 top
D5  139.7,84.45 180 top
D6  139.7,78.1 0 top
D7  114.3,81.91 0 top
D8  114.3,78.74 0 top
D9  45.72,36.2 270 top
D10  125.73,83.18 0 top
D11  135.89,34.29 180 top
D12  135.89,21.59 0 top
D13  135.89,15.24 180 top
D14  135.89,27.94 0 top
D15  135.89,40.64 180 top
D22  107.95,27.94 0 top
D23  107.95,24.76 0 top
D24  117.47,43.18 0 top
D25  139.7,111.12 180 top
D26  139.7,114.3 0 top
D27  139.7,120.65 180 top
D28  139.7,127 0 top
D29  139.7,123.82 180 top
D30  139.7,117.47 0 top
D31  114.3,118.74 0 top
D32  114.3,115.57 0 top
D33  125.73,122.55 0 top
D34  50.8,137.8 270 top
D35  46.99,137.8 90 top
D36  39.37,137.8 270 top
D37  31.75,137.8 90 top
D38  35.56,137.8 270 top
D39  43.18,137.8 90 top
D40  40.64,112.39 90 top
D41  44.45,112.39 90 top
D42  36.83,123.82 90 top
D43  95.25,137.8 270 top
D44  91.44,137.8 90 top
D45  83.82,137.8 270 top
D46  76.2,137.8 90 top
D47  80.01,137.8 270 top
D48  87.63,137.8 90 top
D49  85.09,112.39 90 top
D50  88.9,112.39 90 top
D51  81.92,123.82 90 top
D52  135.89,46.99 0 top
D60  11.43,29.21 90 top
H1  25.4,48.9 90 top
H5  107.31,95.25 0 top
H6  108.58,5.71 0 top
H8  6.99,138.43 0 top
IC1  56.52,87.63 0 top
IC2  38.1,17.14 180 top
IC3  63.5,17.14 180 top
IC4  50.8,17.14 180 top
J1  92.71,49.53 270 top
JP1  61.59,73.02 0 top
K1  130.81,91.44 180 top
K2  130.81,52.07 180 top
K3  130.81,130.81 180 top
K4  27.94,128.91 270 top
K5  72.39,127.64 270 top
OK1  127,70.48 90 top
OK3  119.38,17.78 90 top
OK4  127,109.22 90 top
OK5  50.8,125.09 180 top
OK6  95.25,125.09 180 top
OK7  26.04,6.99 270 top
Q1  61.59,85.09 180 top
R1  139.7,68.58 0 top
R2  114.3,71.75 180 top
R3  59.69,38.73 180 top
R4  59.69,41.27 0 bottom
R5  41.27,64.13 180 top
R6  55.88,66.04 0 top
R7  124.46,88.27 0 top
R8  50.16,72.39 180 top
R9  114.3,69.21 0 top
R10  81.28,24.13 180 top
R11  83.19,45.09 180 top
R12  45.72,41.27 0 top
R13  114.3,85.09 180 top
R14  21.59,100.96 0 top
R16  23.5,69.85 180 top
R18  19.05,8.89 90 top
R19  73.03,68.58 180 top
R20  123.19,8.89 270 top
R21  107.95,17.14 180 top
R22  116.2,53.98 90 top
R23  107.95,13.97 0 top
R24  107.95,30.48 180 top
R25  139.7,107.95 0 top
R26  114.3,108.58 180 top
R27  124.46,127.64 0 top
R28  114.3,104.77 0 top
R29  114.3,121.28 180 top
R30  54.61,137.8 90 top
R31  52.07,112.39 270 top
R32  31.75,122.55 90 top
R33  55.88,112.39 90 top
R34  36.83,112.39 270 top
R35  99.06,137.8 90 top
R36  96.52,112.39 270 top
R37  76.2,122.55 90 top
R38  100.33,112.39 90 top
R39  81.28,112.39 270 top
R42  12.06,23.49 0 top
SG1  22.23,88.9 270 top
SJR1  52.7,52.07 90 bottom
T1  124.46,78.1 0 top
T3  118.11,26.04 0 top
T4  124.46,116.84 0 top
T5  43.18,122.55 90 top
T6  87.63,122.55 90 top
U1  23.5,75.56 90 bottom
V1  90.81,66.04 270 top
X1  140.34,6.35 270 top
X2  17.78,139.06 0 top
X3  140.97,140.34 270 top
X4  140.97,61.59 270 top
X5  140.97,100.96 270 top
X6  62.23,136.53 180 top
X7  8.26,109.85 90 top
X9  8.26,65.41 90 top
X10  8.26,55.25 90 top
X11  8.26,45.09 90 top
X12  8.89,6.99 270 top
X13  8.26,88.27 90 top
X14  8.26,98.42 90 top
X15  8.26,76.83 90 top

### Tracks (layer width: path | path; a pad name or v marks a point on that pad's centre or on a via)
3V3
  Bottom 0.813: C25.2 60.45,26.8 63.5,26.8 | 63.5,26.8 C26.+ 66.17,26.67 68.58,26.67 68.58,41.27 | C8.1 SJR1.8 44.55,42.45 52.07,34.93 60.96,34.93 R3.1 R4.1 68.58,41.27 | R6.2 67.31,66.04 70.48,62.87 70.48,43.18 68.58,41.27 | IC3.GND 63.5,26.8
5V  (via drill 0.35)
  Top 0.61: v112.39,66.04 v116.84,66.04 | v15.88,65.41 v15.88,69.85
  Top 0.813: v57.78,92.71 v52.7,92.71 | v47.62,74.93 v55.24,74.93 | v19.68,109.85 v19.68,114.93
  Bottom 0.61: v116.84,66.04 127.64,66.04 | 127.64,66.04 127.64,73.66 129.54,75.56 R7.2 | R21.2 104.78,17.14 108.58,12.06 117.47,12.06 120.02,14.61 120.02,20.61 122.26,22.85 122.26,32.09 120.65,33.66 120.65,50.16 125.73,50.16 K2.3 125.73,59.05 | U1.4 18.34,77.47 C7.1 | v15.88,65.41 5.71,65.41 5.71,60.33 12.7,60.33 12.7,55.25 5.71,55.25 5.71,50.16 12.7,50.16 12.7,45.09 6.35,45.09 5.71,44.45 5.71,40.01 17.78,40.01 | R2.2 112.39,71.75 v112.39,66.04 | C1.+ 57.78,101.47 IC1.30 | 5.08,82.55 5.08,71.12 14.61,71.12 v15.88,69.85 R16.2 | R22.2 125.73,59.05 | 127.64,66.04 127.64,61.09 C12.+ 125.73,59.18 125.73,59.05
  Bottom 0.813: 57.78,125.73 48.26,125.73 46.35,127.64 R32.2 27.94,127.64 K4.3 27.3,124.46 19.68,124.46 v19.68,114.93 | 57.78,125.73 57.78,127.64 62.87,127.64 | R31.2 52.07,112.39 53.34,113.66 57.78,113.66 57.78,125.73 | R36.2 96.52,113.66 102.23,113.66 102.23,125.73 | 102.23,125.73 92.71,125.73 90.81,127.64 R37.2 72.39,127.64 | 127.64,102.87 118.11,102.87 116.84,104.14 116.84,106.05 114.3,108.58 R26.2 | 127.64,102.87 127.64,112.39 129.54,114.3 R27.2 128.91,127.64 K3.3 125.73,133.35 109.86,133.35 105.92,129.41 | IC2.OUT 35.56,24.13 34.29,25.4 C24.2 35.05,26.8 C27.+ 40.77,26.67 43.18,26.67 43.18,31.75 39.82,35.11 19.5,35.11 17.78,36.83 17.78,40.01 17.78,58.42 25.4,58.42 33.66,66.67 45.09,66.67 R8.2 v47.62,74.93 | C7.1 17.78,80.64 15.88,82.55 5.08,82.55 5.08,98.42 18.41,98.42 18.41,104.14 5.08,104.14 5.08,109.85 v19.68,109.85 | IC1.30 v57.78,92.71 | v52.7,92.71 48.9,88.9 C30.1 48.9,83.82 49.53,83.18 53.98,83.18 54.61,82.55 54.61,80.64 IC1.10 v55.24,74.93 | R7.2 129.54,91.44 | 129.54,91.44 129.54,100.33 127.64,100.33 | K1.3 129.54,91.44 | K5.3 72.39,127.64 | 72.39,127.64 62.87,127.64 | 102.23,125.73 105.92,129.41 | 105.92,129.41 C10.+ | C14.+ 127.64,100.33 | C16.+ 62.87,127.64 | 127.64,102.87 127.64,100.33
5V_2  (via drill 0.35)
  Top 0.61: v104.14,49.53 v99.06,49.53 | v91.44,64.77 v91.44,69.21
  Top 0.813: v70.48,19.05 v78.11,19.05
  Bottom 0.61: v99.06,49.53 J1.2 | v91.44,69.21 91.44,74.93 V1.16 94.61,79.38 93.98,80.01 C20.1 93.34,80.64 85.72,80.64 78.11,73.02 | v91.44,64.77 91.44,62.23 93.98,59.69 V1.10 97.79,59.69 104.14,53.34 v104.14,49.53 106.05,49.53 C6.1
  Bottom 0.813: IC4.OUT 48.26,23.49 46.99,24.76 C28.2 52.58,26.04 C29.+ 54.48,26.8 55.88,25.4 55.88,20.95 | 55.88,20.95 55.88,16.51 57.78,14.61 69.22,14.61 70.48,15.88 v70.48,19.05 | 78.11,73.02 R19.1 78.11,48.26 80.01,46.36 80.01,43.82 75.56,39.37 75.56,27.94 78.11,25.4 v78.11,19.05 | IC3.OUT 55.88,20.95
9V_AC1
  Bottom 0.813: X12.1 9.53,11.39 B2.AC1 13.97,17.78 17.78,17.78 19.68,19.68 19.68,23.49 26.04,23.49 27.3,22.22 B3.AC1
9V_AC2
  Bottom 0.813: X12.2 10.76,4.49 10.79,4.45 14.61,8.26 B2.AC2 17.14,15.88 20.32,15.88 22.23,17.78 B3.AC2
A
  Bottom 0.61: R10.1 92.71,24.13 J1.15
A_RX
  Bottom 0.61: JP1.8 IC1.14
A_TX  (via drill 0.35)
  Top 0.61: v62.87,76.83 v67.94,76.83
  Bottom 0.61: JP1.6 v62.87,76.83 | v67.94,76.83 IC1.15
BUZZER
  Bottom 0.61: SG1.+ 27.3,80.01 IC1.1
CH_PD  (via drill 0.35)
  Top 0.813: v60.33,63.5 v55.24,63.5
  Bottom 0.61: JP1.3 60.33,71.12 55.24,66.04 v55.24,63.5
  Bottom 0.813: SJR1.3 54.55,41.34 R4.2 52.7,39.37 52.7,36.83 59.69,36.83 61.59,38.73 61.59,42.55 62.23,43.18 67.94,43.18 68.58,43.82 68.58,62.23 67.31,63.5 v60.33,63.5
CH_PD_MEGA  (via drill 0.35)
  Top 0.61: v50.16,76.83 v60.33,76.83
  Bottom 0.61: IC1.8 v50.16,76.83 | v60.33,76.83 JP1.4
CON_PWM
  Bottom 0.813: R11.2 76.2,45.09 76.2,74.93 78.11,76.83 IC1.19
D4
  Bottom 0.61: J1.11 90.17,36.83 88.9,35.56 88.9,27.3 81.28,27.3 78.74,29.84 78.74,38.1 83.82,43.18 83.82,69.85 V1.3
D5  (via drill 0.35)
  Top 0.61: v99.06,36.83 v102.87,36.83 | v82.55,54.61 v92.71,54.61
  Bottom 0.61: J1.12 v99.06,36.83 | v102.87,36.83 102.87,52.71 100.97,54.61 v92.71,54.61 | v82.55,54.61 82.55,71.12 83.82,72.39 V1.2
D6
  Bottom 0.61: 77.52,38.79 81.28,42.55 81.28,72.39 83.82,74.93 V1.1 | 77.52,38.79 77.52,34.93 | 77.52,38.79 77.47,34.93 77.47,28.57 80.01,26.04 90.17,26.04 90.17,33.02 91.44,34.29 J1.13
D7  (via drill 0.35)
  Top 0.61: v102.87,34.29 v99.06,34.29 | v102.23,72.39 v97.16,72.39
  Bottom 0.61: v99.06,34.29 J1.14 | v97.16,72.39 V1.15 | v102.23,72.39 102.23,58.42 107.72,52.93 107.72,37.45 104.56,34.29 v102.87,34.29
DOOR_SEN
  Bottom 0.61: X11.1 13.38,42.59 15.88,45.09 15.88,60.33 24.77,60.33 33.02,68.58 43.18,68.58 43.18,74.93 47.62,79.38 IC1.7
DW
  Bottom 0.61: X14.1 9.56,95.88 21.59,95.88 21.59,102.87 29.21,102.87 32.38,99.69 IC1.40
E_5
  Bottom 0.813: SJR1.5 50.8,44.2 R12.2
E_8
  Bottom 0.813: SJR1.10 46.55,63.95 R5.1
E_RX
  Bottom 0.61: SJR1.15 57.03,61.14 57.03,66.06 62.72,71.75 JP1.5
E_TX
  Bottom 0.61: SJR1.16 59,61.11 59,66.31 62.77,70.08 63.56,70.08 65.24,71.75 JP1.7
EN
  Bottom 0.61: J1.6 101.6,44.45 101.6,52.07 100.33,53.34 91.44,53.34 90.81,53.98 90.81,59.05 87.63,62.23 V1.6
EN_HEATER_SSR
  Bottom 0.61: X7.1 27.9,107.35 37.47,97.79 40.01,97.79 IC1.37
EN_PUMP
  Bottom 0.61: IC1.24 73.03,87.63 99.69,87.63 103.5,83.82 103.5,59.05 109.22,53.34 109.22,36.83 104.78,32.39 102.23,32.39 100.97,31.11 100.97,16.51 R23.1
EN_S1_GAS
  Bottom 0.61: IC1.33 50.16,100.96 55.88,106.68 R33.1
EN_S2_WAT
  Bottom 0.61: R28.1 109.22,101.6 108.58,100.96 67.94,100.96 IC1.26
EN_S3_VAP
  Bottom 0.61: R38.1 100.33,103.5 64.77,103.5 62.87,101.6 IC1.28
EN_S4_DRY
  Bottom 0.61: R9.1 106.05,69.21 106.05,85.09 99.69,91.44 78.11,91.44 IC1.22
GND  (via drill 0.35)  (6 unrouted)
  Top 0.61: v85.09,52.07 v80.01,52.07
  Top 0.813: v74.93,21.59 v70.48,21.59
  Bottom 0.61: OK1.3 121.92,73.02 T1.E 121.92,78.74 | 114.3,24.76 T3.E 115.57,30.48 R24.1 113.03,33.02 112.39,33.66 112.39,45.72 114.3,47.62 114.3,54.61 | 114.3,24.76 D23.A | D32.A 115.57,115.57 114.94,114.93 114.94,110.49 107.31,110.49 107.31,106.68 113.67,106.68 114.94,105.41 114.94,100.33 | D50.A 88.9,114.3 90.81,112.39 94.61,112.39 94.61,106.05 95.25,105.41 97.79,105.41 98.42,106.05 98.42,110.49 102.87,110.49 104.14,111.76 104.14,123.95 C10.- 110.36,130.18 C34.2 116.2,130.18 116.2,124.46 R29.1 121.92,121.28 T4.E | 58.42,111.12 59.69,111.12 62.87,114.3 | 58.42,111.12 54.61,111.12 53.98,110.49 53.98,106.68 52.7,105.41 50.16,105.41 | 50.16,105.41 50.16,112.39 46.35,112.39 46.35,113.03 44.45,114.93 D41.A | C7.2 18.34,73.66 U1.1 20.88,68.5 20.28,67.91 12.66,67.91 | 24.13,112.39 24.77,112.39 | IC1.31 55.24,100.46 C1.- 58.42,105.92 58.42,111.12 | J1.9 J1.7 | J1.7 J1.5 | J1.7 J1.8 J1.10 | J1.9 J1.10 | J1.9 89.53,39.37 87.63,37.47 87.63,28.57 82.55,28.57 C11.1 81.28,30.48 81.28,37.34 C4.- 85.72,41.78 85.72,48.26 87,49.53 | 87,52.07 V1.8 | 100.97,39.37 100.97,33.66 99.06,31.75 J1.16 95.25,22.86 88.9,16.51 74.93,16.51 | J1.10 100.97,39.37 | 3.17,20.95 3.17,1.91 3.61,1.47 29.84,1.47 70.05,1.47 74.93,6.35 | C6.2 100.97,39.37 | 87,52.07 v85.09,52.07 | v80.01,52.07 80.01,73.02 85.72,78.74 C20.2 88.27,78.51 89.53,78.51 89.53,67.31 V1.13 | C33.2 114.3,54.61 | 114.3,54.61 114.3,60.96 | 114.3,60.96 114.3,76.83 117.47,76.83 D8.A 121.92,78.74 | C35.2 27.94,114.93 36.83,114.93 | J1.1 87,49.53 | 87,52.07 87,49.53 | 121.92,78.74 121.92,82.55 R13.1 116.84,85.09 116.84,95.88 C32.2 114.94,100.33 | 50.16,105.41 48.9,105.41 46.86,103.38
  Bottom 0.61: C12.- 114.3,60.96 | C14.- 114.94,100.33 | OK3.3 114.3,20.32 114.3,24.76
  Bottom 0.813: D50.A T6.E | 36.83,114.93 R34.1 39.37,120.02 T5.E | OK5.3 48.26,120.02 T5.E | OK6.3 92.71,120.02 T6.E | D41.A T5.E | OK4.3 121.92,110.49 T4.E D32.A | 3.17,100.96 3.17,90.8 | 3.17,90.8 3.21,90.77 | 3.21,67.91 X9.2 12.66,67.91 | 3.21,67.91 3.17,67.94 3.17,90.8 | X10.2 3.21,57.75 3.17,57.79 | 3.17,57.79 3.17,67.86 3.21,67.91 | 3.17,57.79 3.17,47.62 | 3.17,47.62 3.21,47.59 X11.2 | 3.17,47.62 3.17,30.48 | 3.17,30.48 3.17,20.95 B2.- | C27.- 39.88,31.11 C24.1 32.38,31.11 | 43.18,24.13 38.1,24.13 IC2.GND 38.1,16.51 33.66,16.51 32.38,17.78 32.38,31.11 | 43.18,24.13 43.18,16.51 50.8,16.51 IC4.GND | 43.18,24.13 45.09,26.04 45.09,31.11 45.72,31.11 | 45.72,31.11 C28.1 52.58,31.11 C29.- 58.29,30.35 59.05,31.11 C25.1 60.45,30.35 C26.- | 3.21,112.35 3.17,112.39 | 3.17,112.39 3.17,100.96 | 3.17,112.39 9.48,112.39 X7.2 9.56,112.39 24.77,112.39 C35.2 | 3.17,100.96 3.21,100.92 X14.2 16.47,100.92 R14.1 | SJR1.9 35.88,60.65 | 35.88,60.65 35.87,60.65 | R5.2 35.56,63.5 35.56,60.33 | 35.88,60.65 35.56,60.33 | C5.1 C3.1 59.69,90.8 55.24,90.8 | 55.24,90.8 53.98,90.8 C30.2 54.61,85.09 57.78,81.91 IC1.11 | 55.24,90.8 IC1.31 | 45.72,31.11 D9.K 43.81,34.93 40.01,38.73 35.56,38.73 35.56,44.45 | OK7.3 29.84,1.47 | T6.E 83.82,120.02 R39.1 78.11,114.3 77.47,114.3 | 77.47,114.3 62.87,114.3 C16.- | C36.2 77.47,114.3 | 27.43,31.11 C22.- 26.04,30.99 26.04,31.11 | 32.38,31.11 27.43,31.11 | 26.04,31.11 C23.1 12.7,31.11 D60.K 3.17,30.48 | 27.43,31.11 26.04,31.11 | 74.93,6.35 74.93,16.51 v74.93,21.59 | v70.48,21.59 66.67,21.59 IC3.IN | 35.56,60.33 35.56,44.45 | C8.2 35.56,44.45
  pour Bottom: 0,147.32 12.7,147.32 12.7,133.99 130.18,135.25 130.81,134.62 129.54,25.4 125.73,19.68 120.65,19.68 120.65,0 0,-0.64
HEATER_FED_SIG  (2 unrouted)
IO0
  Bottom 0.813: SJR1.12 50.8,60.91 R6.1
L
  Bottom 0.61: 123.23,3.85 R20.2
  Bottom 0.813: R1.2 D1.C 147.32,71.75 147.32,78.1 | 147.32,78.1 D6.A | 147.32,78.1 147.32,107.95 R25.2 D25.C 147.32,111.12 147.32,117.47 | 147.32,117.47 D30.A | 147.32,117.47 147.32,145.42 99.06,145.42 R35.2 D43.C 95.25,145.42 87.63,145.42 | 87.63,145.42 D48.A | 87.63,145.42 54.61,145.42 R30.2 D34.C 50.8,145.42 43.18,145.42 D39.A
  Bottom 1.27: 147.96,27.94 147.96,68.58 R1.2 | D14.A 147.96,27.94 | D13.C 147.96,15.24 | 147.96,15.24 147.96,27.94 | 147.96,15.24 147.96,3.81 143.51,3.81 143.47,3.85 X1.2 123.23,3.85
LCD_CLK
  Bottom 0.61: V1.11 100.97,62.23 100.97,81.91 97.16,85.72 71.12,85.72 71.12,93.34 70.48,93.98 IC1.25
LCD_D
  Bottom 0.61: V1.14 98.42,69.85 98.42,80.01 96.52,81.91 80.64,81.91 IC1.20
LCD_L
  Bottom 0.61: V1.12 99.69,64.77 99.69,81.28 97.16,83.82 73.03,83.82 IC1.17
LED_PWM
  Bottom 0.813: IC1.18 75.56,78.1 74.3,76.83 74.3,41.27 73.03,40.01 73.03,27.3 R10.2
N
  Bottom 0.813: 139.7,98.42 139.7,69.21 135.89,65.41 135.89,59.05 139.06,59.05 139.7,59.05 X4.2 | 139.7,98.42 X5.2 | 135.89,98.42 135.89,104.77 139.7,107.95 X3.2 80.05,137.84 80.01,137.8 68.58,137.8 68.58,133.99 59.69,133.99 59.69,137.75 X6.2 X2.2 | 135.89,98.42 135.93,98.46 | 135.89,98.42 139.7,98.42
  Bottom 1.27: X1.1 135.89,12.03 135.89,41.91 139.06,45.09 139.06,59.05
N$1
  Bottom 0.813: D2.A 142.24,74.93 142.24,81.28 D3.C
N$2
  Bottom 0.813: D1.A D2.C
N$3
  Bottom 0.61: C2.2 116.84,71.75 R2.1 121.92,69.21 OK1.4
N$4
  Bottom 0.61: C2.1 111.76,78.74 | 111.76,78.74 D8.C | 111.76,78.74 116.2,78.74 D7.A
N$5
  Bottom 0.813: D6.C 137.16,78.1 137.16,84.45 D5.A
N$6
  Bottom 0.813: D5.C D4.A
N$7
  Bottom 0.813: IC1.13 62.87,83.82 Q1.1 65.41,85.09 C5.2
N$8
  Bottom 0.61: T1.C D10.K 127,84.45 123.19,88.27 K1.4
N$9
  Bottom 0.61: R1.1 131.44,68.58 OK1.1
N$10
  Bottom 1.27: D12.A 139.06,21.59 139.06,34.29 D11.C
N$11
  Bottom 0.61: D10.A R7.1
N$12
  Bottom 0.813: D9.A 41.91,41.27 R12.1
N$13
  Bottom 0.61: R9.2 119.38,67.31 125.73,67.31 125.73,73.66 124.46,74.93 T1.B
N$14
  Bottom 0.813: OK1.2 132.08,73.02 132.08,81.28 | 132.08,81.28 132.08,87.63 D4.C 134.62,90.17 K1.2 | D3.A 132.08,81.28
N$15
  Bottom 1.27: D13.A D12.C
N$16
  Bottom 0.813: IC1.12 60.33,83.18 59.05,84.45 Q1.2 59.05,86.36 C3.2
N$17
  Bottom 1.27: D14.C 132.72,27.94 132.72,40.64 D15.A
N$18
  Bottom 1.27: D15.C D52.A
N$19
  Bottom 0.61: OK3.1 R20.1
N$20
  Bottom 0.61: C13.2 110.49,19.68 R21.1 113.67,16.51 OK3.4
N$21
  Bottom 0.61: D23.C 105.41,24.76 | 105.41,24.76 107.95,24.76 111.12,27.94 D22.A | C13.1 105.41,24.76
N$23
  Bottom 0.61: D24.A R22.1
N$24
  Bottom 0.61: T3.C 120.65,31.64 118.75,33.54 D24.K 118.75,52.07 K2.4
N$25
  Bottom 0.61: T3.B 118.11,14.61 117.47,13.97 R23.2
N$26
  Bottom 0.813: D26.A 142.24,114.3 142.24,120.65 D27.C
N$27
  Bottom 0.813: D25.A D26.C
N$28
  Bottom 0.813: D30.C 137.16,117.47 137.16,123.82 D29.A
N$29
  Bottom 0.813: D29.C D28.A
N$30
  Bottom 0.813: R25.1 OK4.1
N$31
  Bottom 0.61: OK4.4 120.02,107.95 R26.1
  Bottom 0.813: C15.2 116.84,108.58 R26.1
N$32
  Bottom 0.813: D32.C 111.76,115.57 | 111.76,115.57 C15.1 | 111.76,115.57 114.94,118.74 D31.A
N$33
  Bottom 0.813: 132.08,120.65 132.08,127 D28.C 134.62,129.54 K3.2 | 132.08,120.65 D27.A | 132.08,120.65 132.08,111.76 OK4.2
N$34
  Bottom 0.61: D33.A R27.1
N$35
  Bottom 0.61: D33.K 127,123.19 123.19,127 K3.4
  Bottom 0.813: D33.K T4.C
N$36
  Bottom 0.813: R28.2 125.73,104.77 125.73,112.39 124.46,113.66 T4.B
N$37
  Bottom 0.813: D36.C 39.37,140.34 46.99,140.34 D35.A
N$38
  Bottom 0.813: D34.A D35.C
N$39
  Bottom 0.813: D39.C 43.18,135.25 35.56,135.25 D38.A
N$40
  Bottom 0.813: D38.C D37.A
N$41
  Bottom 0.813: OK5.1 54.61,131.45 R30.1
N$42
  Bottom 0.813: OK5.4 R31.1 49.53,114.93 C17.2
N$43
  Bottom 0.813: D40.A 40.64,113.66 42.55,111.76 44.45,109.85 | 44.45,109.85 C17.1 | D41.C 44.45,109.85
N$44
  Bottom 0.813: K4.2 27.94,132.72 D37.C 34.29,130.18 39.37,130.18 | 39.37,130.18 D36.A | 39.37,130.18 46.99,130.18 48.26,128.91 OK5.2
N$45
  Bottom 0.813: R32.1 D42.A
N$46
  Bottom 0.813: T5.C D42.K 34.29,125.09 30.48,121.28 K4.4
N$47
  Bottom 0.813: B3.+ 19.05,13.34 R18.2
N$48
  Bottom 0.813: R18.1 19.05,8.26 OK7.1
N$49
  Bottom 0.813: OK7.2 26.04,5.71 26.04,12.06 B3.-
N$51
  Bottom 0.61: 123.83,34.29 124.44,34.27 124.44,20.69 123.19,19.44 OK3.2
  Bottom 1.27: D11.A 123.83,34.29 123.83,46.53 124.14,46.87 128.15,46.87 D52.C 132.72,46.99 135.89,50.16 K2.2
N$52
  Bottom 0.813: R33.2 55.88,121.28 53.34,123.82 46.99,123.82 45.72,122.55 T5.B
N$53
  Bottom 0.813: D45.C 83.82,140.34 91.44,140.34 D44.A
N$56
  Bottom 0.813: D44.C D43.A
N$57
  Bottom 0.813: D47.A 80.01,135.25 87.63,135.25 D48.C
N$58
  Bottom 0.813: D46.A D47.C
N$59
  Bottom 0.813: R35.1 96.52,130.18 OK6.1
N$60
  Bottom 0.813: C19.2 95.25,117.47 R36.1 OK6.4
N$61
  Bottom 0.813: D49.A 85.09,114.93 88.9,111.12 | 88.9,111.12 90.17,109.85 C19.1 | D50.C 88.9,111.12
N$62
  Bottom 0.813: SG1.- 26.67,92.71 R14.2
N$63
  Bottom 0.813: K5.2 D46.C 78.74,130.18 83.82,130.18 | 83.82,130.18 D45.A | 83.82,130.18 91.44,130.18 92.71,128.91 OK6.2
N$64
  Bottom 0.813: R37.1 81.28,122.55 D51.A
N$65
  Bottom 0.813: T6.C D51.K 80.64,125.09 75.56,120.02 K5.4
N$66
  Bottom 0.813: T6.B 91.44,122.55 92.71,123.82 100.33,123.82 R38.2
N$74
  Bottom 0.813: D60.A R42.1
NRST
  Bottom 0.813: SJR1.1 58.55,38.86 58.42,38.73 R3.2
OK
  Bottom 0.61: X13.2 17.18,90.77 17.78,90.17 33.02,90.17 34.92,92.07 IC1.39
OUT_PUMP
  Bottom 0.813: K5.1 64.77,140.34 64.73,140.3 X6.1
OUT_S1_GAS
  Bottom 0.813: K4.1 15.24,141.61 15.28,141.56 X2.1
OUT_S2_WAT
  Bottom 0.813: K3.1 143.51,142.88 139.74,142.88 X3.1
OUT_S3_VAP
  Bottom 1.27: K2.1 143.51,53.9 143.55,64.09 | 143.51,61.59 143.55,64.09 | 143.55,64.09 X4.1
OUT_S4_DRY
  Bottom 0.813: K1.1 143.51,103.5 139.74,103.5 X5.1
PRES_SEN
  Bottom 0.61: X10.1 13.38,52.75 14.61,53.98 14.61,61.59 23.5,61.59 31.75,69.85 41.91,69.85 41.91,76.2 45.09,79.38 IC1.6
PUMP_FED_SIG
  Bottom 0.61: D22.C R24.2 105.41,30.48 110.49,35.56 110.49,49.53 | IC1.23 75.56,89.53 99.69,89.53 104.78,84.45 104.78,59.69 110.49,53.98 110.49,49.53 | C33.1 110.49,49.53
REST
  Bottom 0.61: R8.1 57.15,74.3 JP1.2
  Bottom 0.813: R8.1 52.7,74.93 IC1.9
REST_OUT
  Bottom 0.61: SJR1.13 52.55,65.16 52.65,65.27 52.65,65.35 57.78,70.48 JP1.1 57.78,71.12
  Bottom 0.813: SJR1.13 52.7,60.81
RS
  Bottom 0.61: J1.4 100.33,46.99 100.33,51.44 99.69,52.07 90.81,52.07 89.23,53.65 89.23,58.09 87.63,59.69 V1.7
S1_GAS_FED_SIG
  Bottom 0.61: D40.C 45.09,102.87 IC1.35 | 36.83,111.12 35.56,112.39 C35.1
  Bottom 0.813: 36.83,111.12 R34.2 D40.C
S2_WAT_FED_SIG
  Bottom 0.61: D31.C 106.05,115.57 106.05,111.76 104.78,110.49 104.78,102.23 66.04,102.23 65.41,101.6 IC1.27 | R29.2 113.03,125.09 C34.1
  Bottom 0.813: D31.C R29.2
S3_VAP_FED_SIG
  Bottom 0.61: R39.2 79.38,105.41 72.39,105.41 | 72.39,105.41 62.87,105.41 60.33,102.87 IC1.29 | 72.39,105.41 C36.1
  Bottom 0.813: D49.C R39.2
S4_DRY_FED_SIG
  Bottom 0.61: D7.C R13.2 | IC1.21 80.64,93.34 100.97,93.34 R13.2 | C32.1 R13.2
T_CLK
  Bottom 0.61: U1.6 37.47,76.2 IC1.3
T_CS
  Bottom 0.61: U1.5 34.92,77.47 IC1.2
T_DO
  Bottom 0.61: U1.7 39.37,74.93 39.37,78.1 40.01,78.74 IC1.4
TCK+
  Bottom 0.61: X15.2 9.56,79.38 12.7,79.38 15.88,76.2 U1.3
TCK-
  Bottom 0.61: X15.1 15.28,74.33 15.88,74.93 U1.2
UP
  Bottom 0.61: X13.1 15.28,85.77 18.41,88.9 34.92,88.9 37.47,91.44 IC1.38
VEE
  Bottom 0.61: C11.2 85.72,30.54 84.96,31.29 C4.+ 88.27,40.77 R11.1 90.17,46.99 J1.3
VIN
  Bottom 0.813: B2.+ R42.2 17.14,26.04 C23.2 27.94,26.04 | 40.64,14.61 30.48,14.61 29.84,15.24 29.84,24.13 27.94,26.04 | 40.64,14.61 IC2.IN | 40.64,14.61 53.34,14.61 IC4.IN | C22.+ 27.18,26.8 27.94,26.04
WATER_SEN
  Bottom 0.61: 14.64,62.91 X9.1 21.63,62.91 23.5,64.77 23.5,69.85 | 23.5,69.85 23.5,79.38 19.05,83.82 19.05,86.99 19.68,87.63 43.81,87.63 47.62,91.44 IC1.34 | R16.1 23.5,69.85
ZERO_CROSS
  Bottom 0.813: 70.48,68.58 70.48,66.04 72.39,64.13 72.39,41.91 71.12,40.64 71.12,25.4 72.39,24.13 72.39,13.97 70.97,12.55 34.14,12.55 OK7.4 | 70.48,68.58 IC1.16 | R19.2 70.48,68.58

### Text on the board
tNames: S2 WAT | S1 GAS | S3 VAP | HEATER SSR | SWITCHS | S4 DRY | THERMO_K | WATER SEN | PUMP | PRESS SEN | DOOR SEN | WIFI LED | POWER | LCD | START Autoclave / H/W : V2 / S/W : V2 / MADE IN EGYPT | 9V AC | 220V